# EAGLE design ACB-Light-R1.0-J01 (EAGLE 6.6.0)
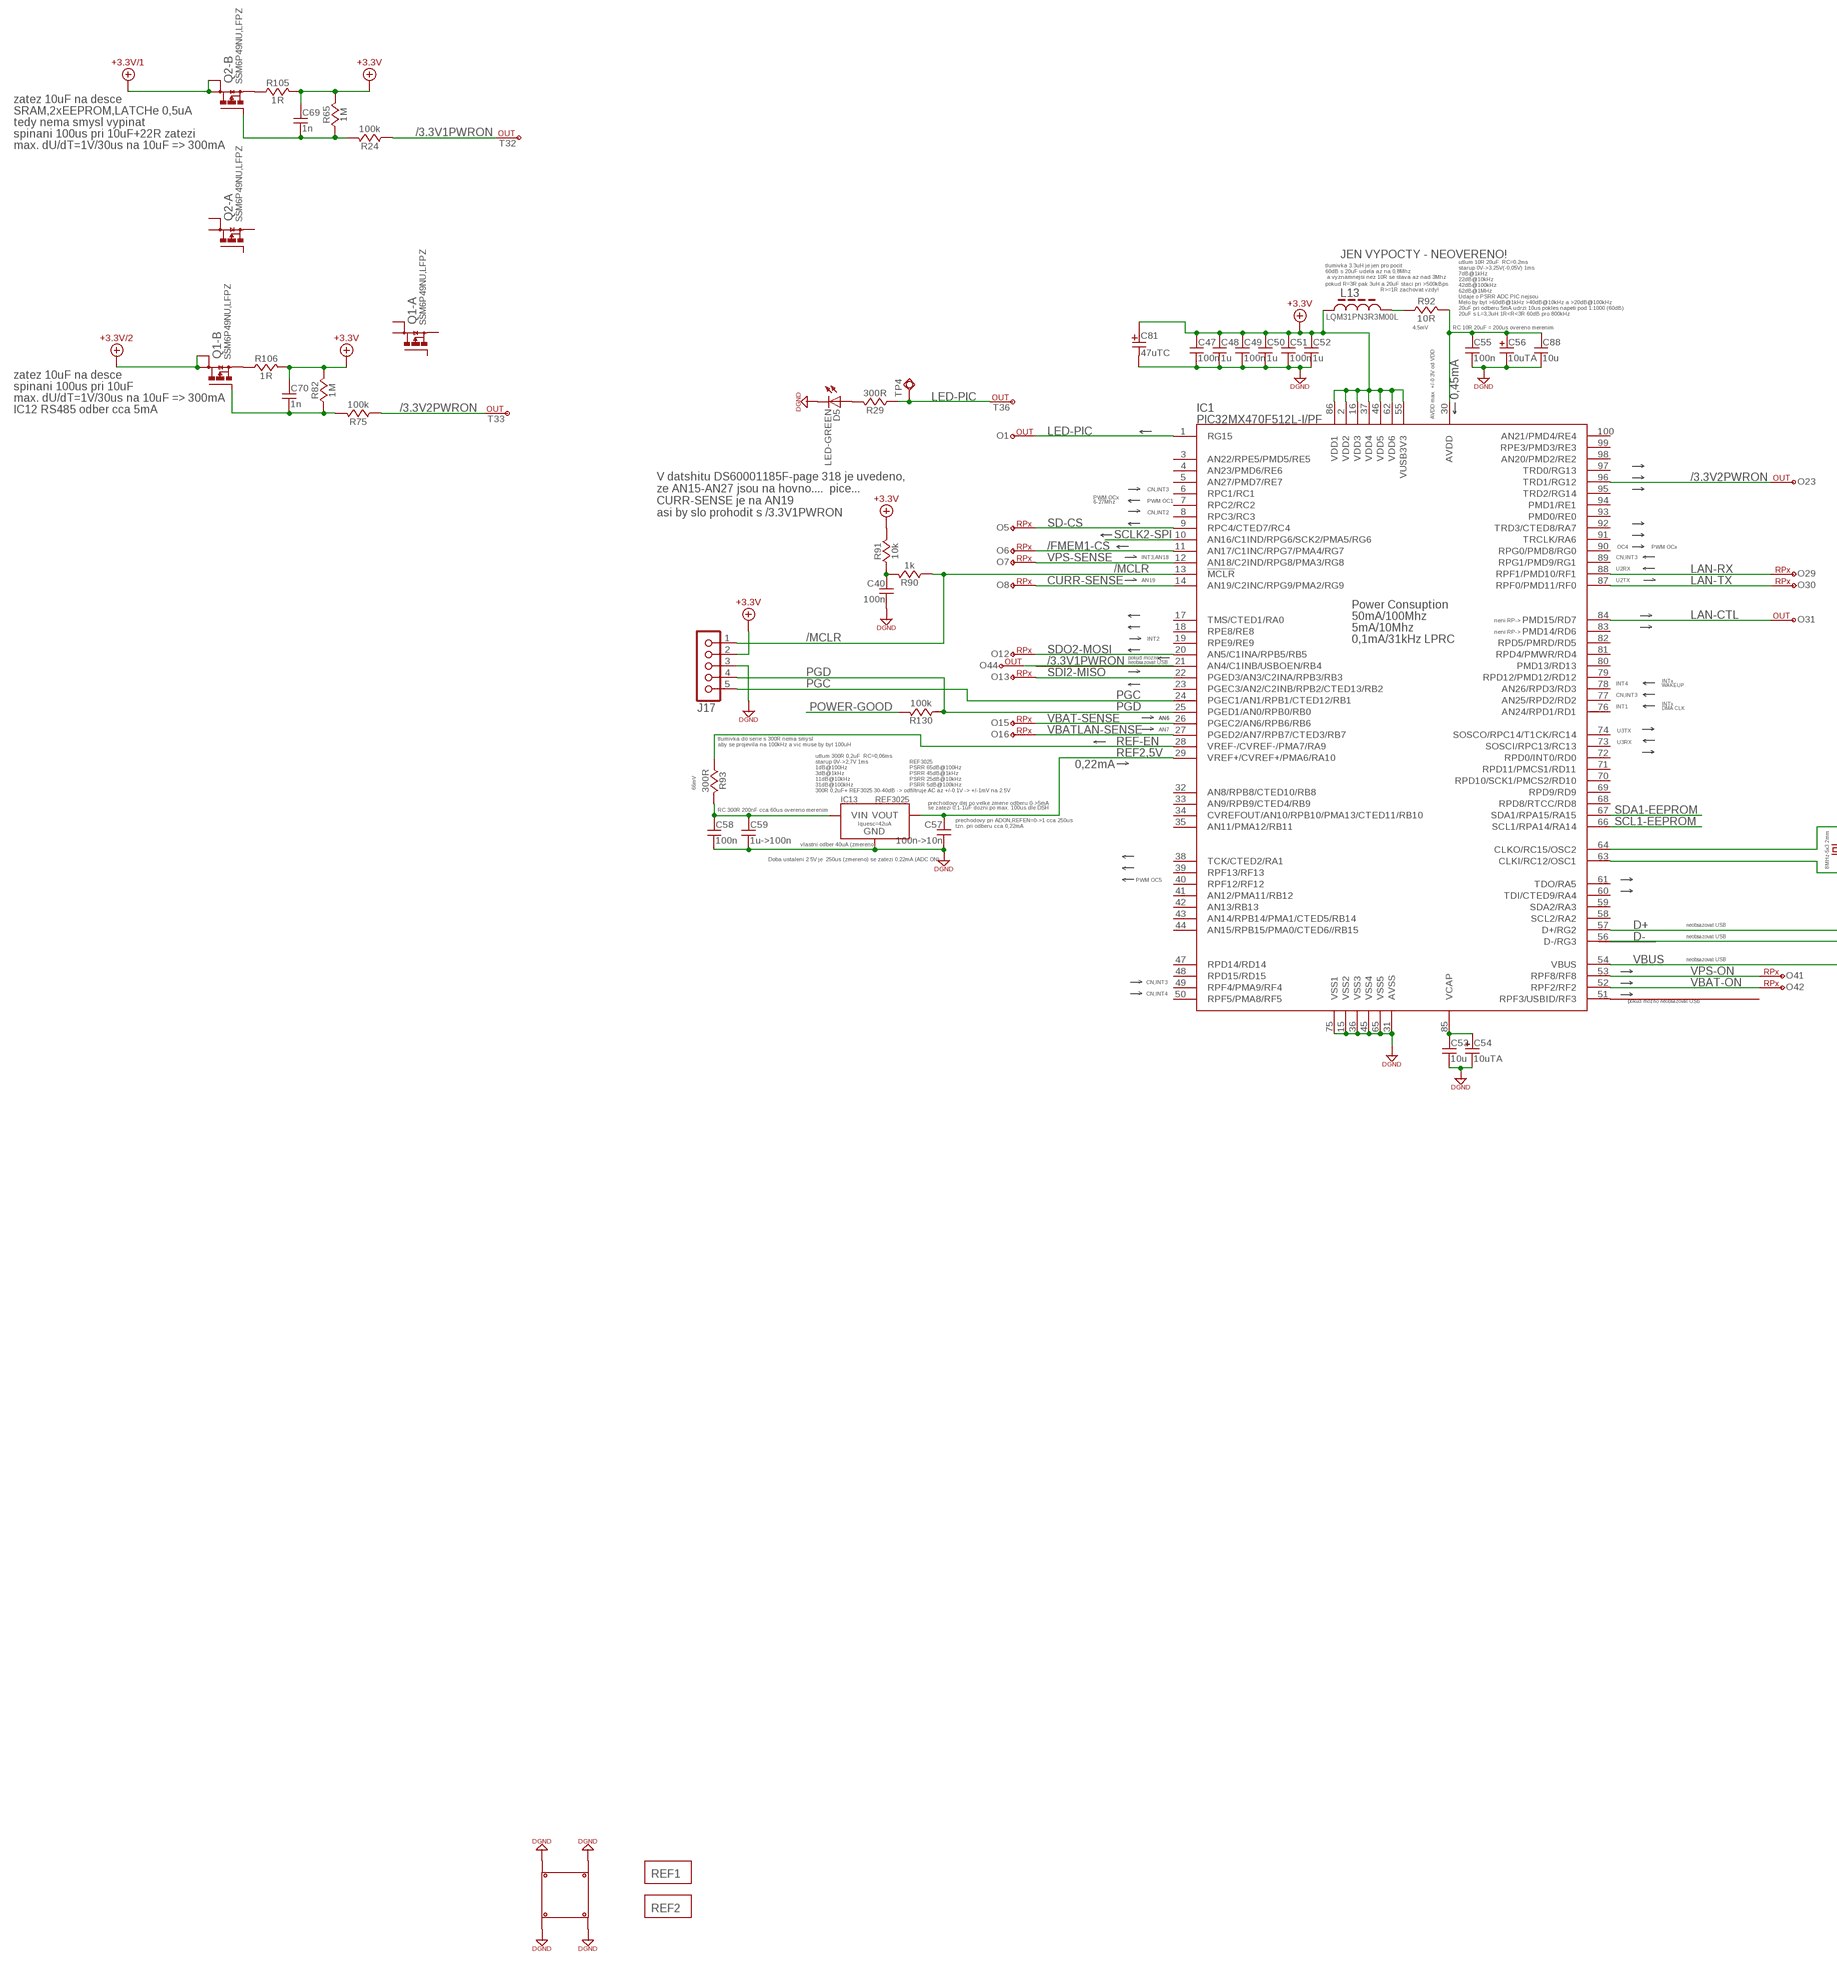
[diagram p0: schematic, sheet 1, part 1 of 3]
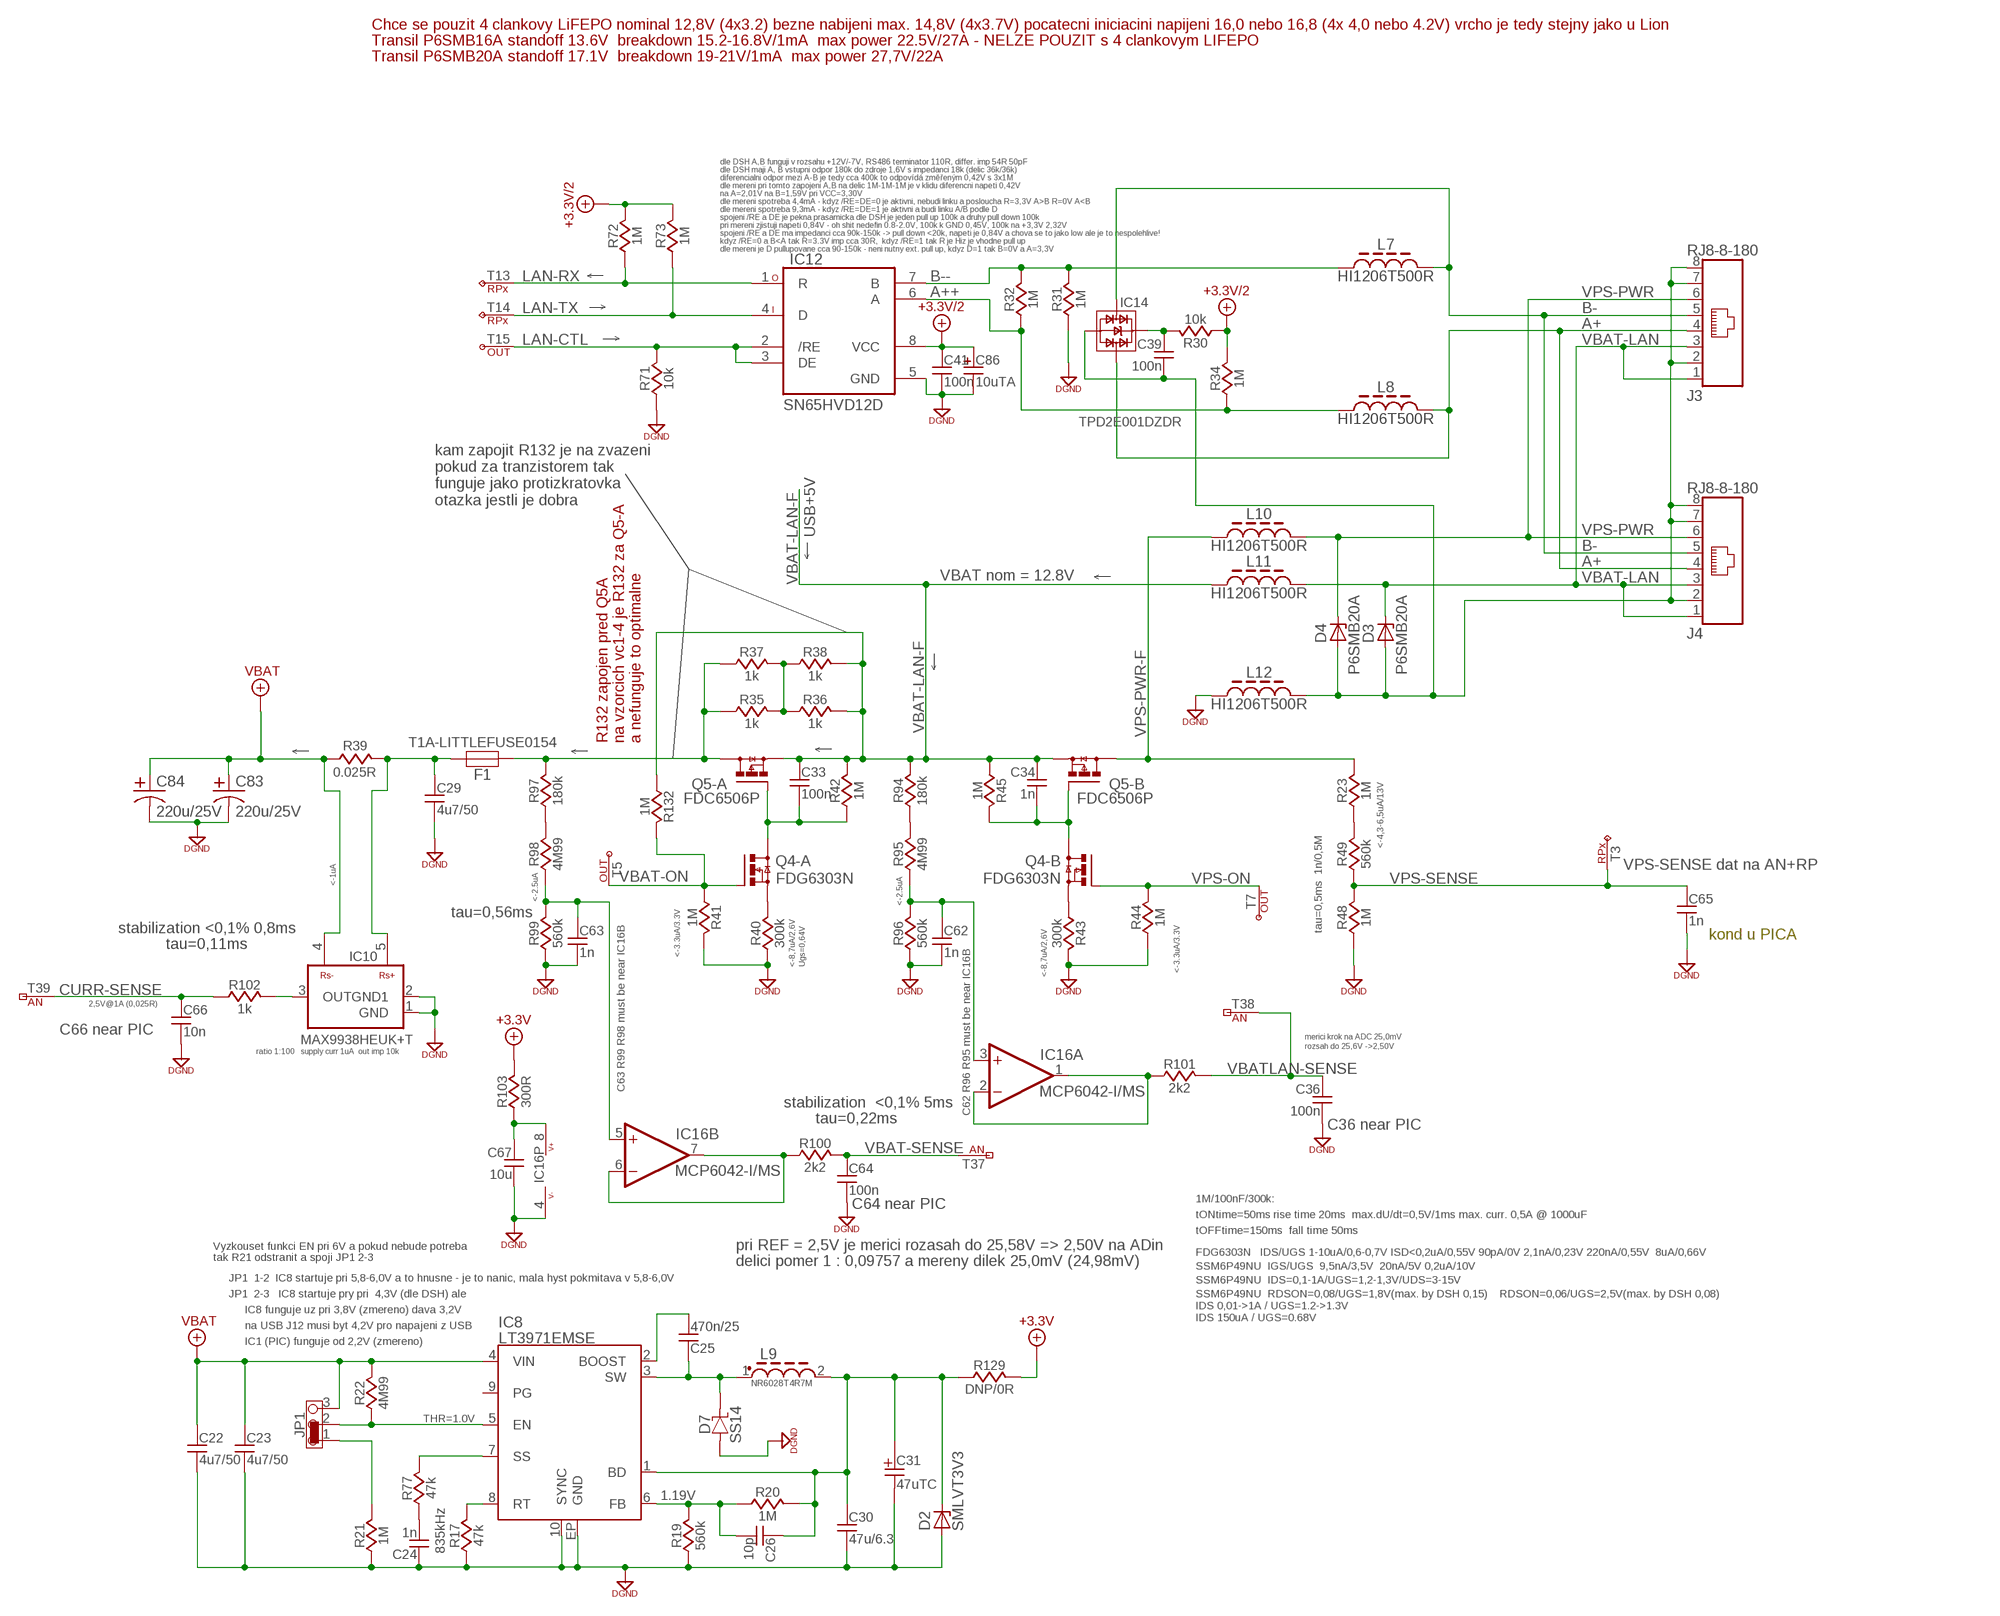
[diagram p1: schematic, sheet 1, part 2 of 3]
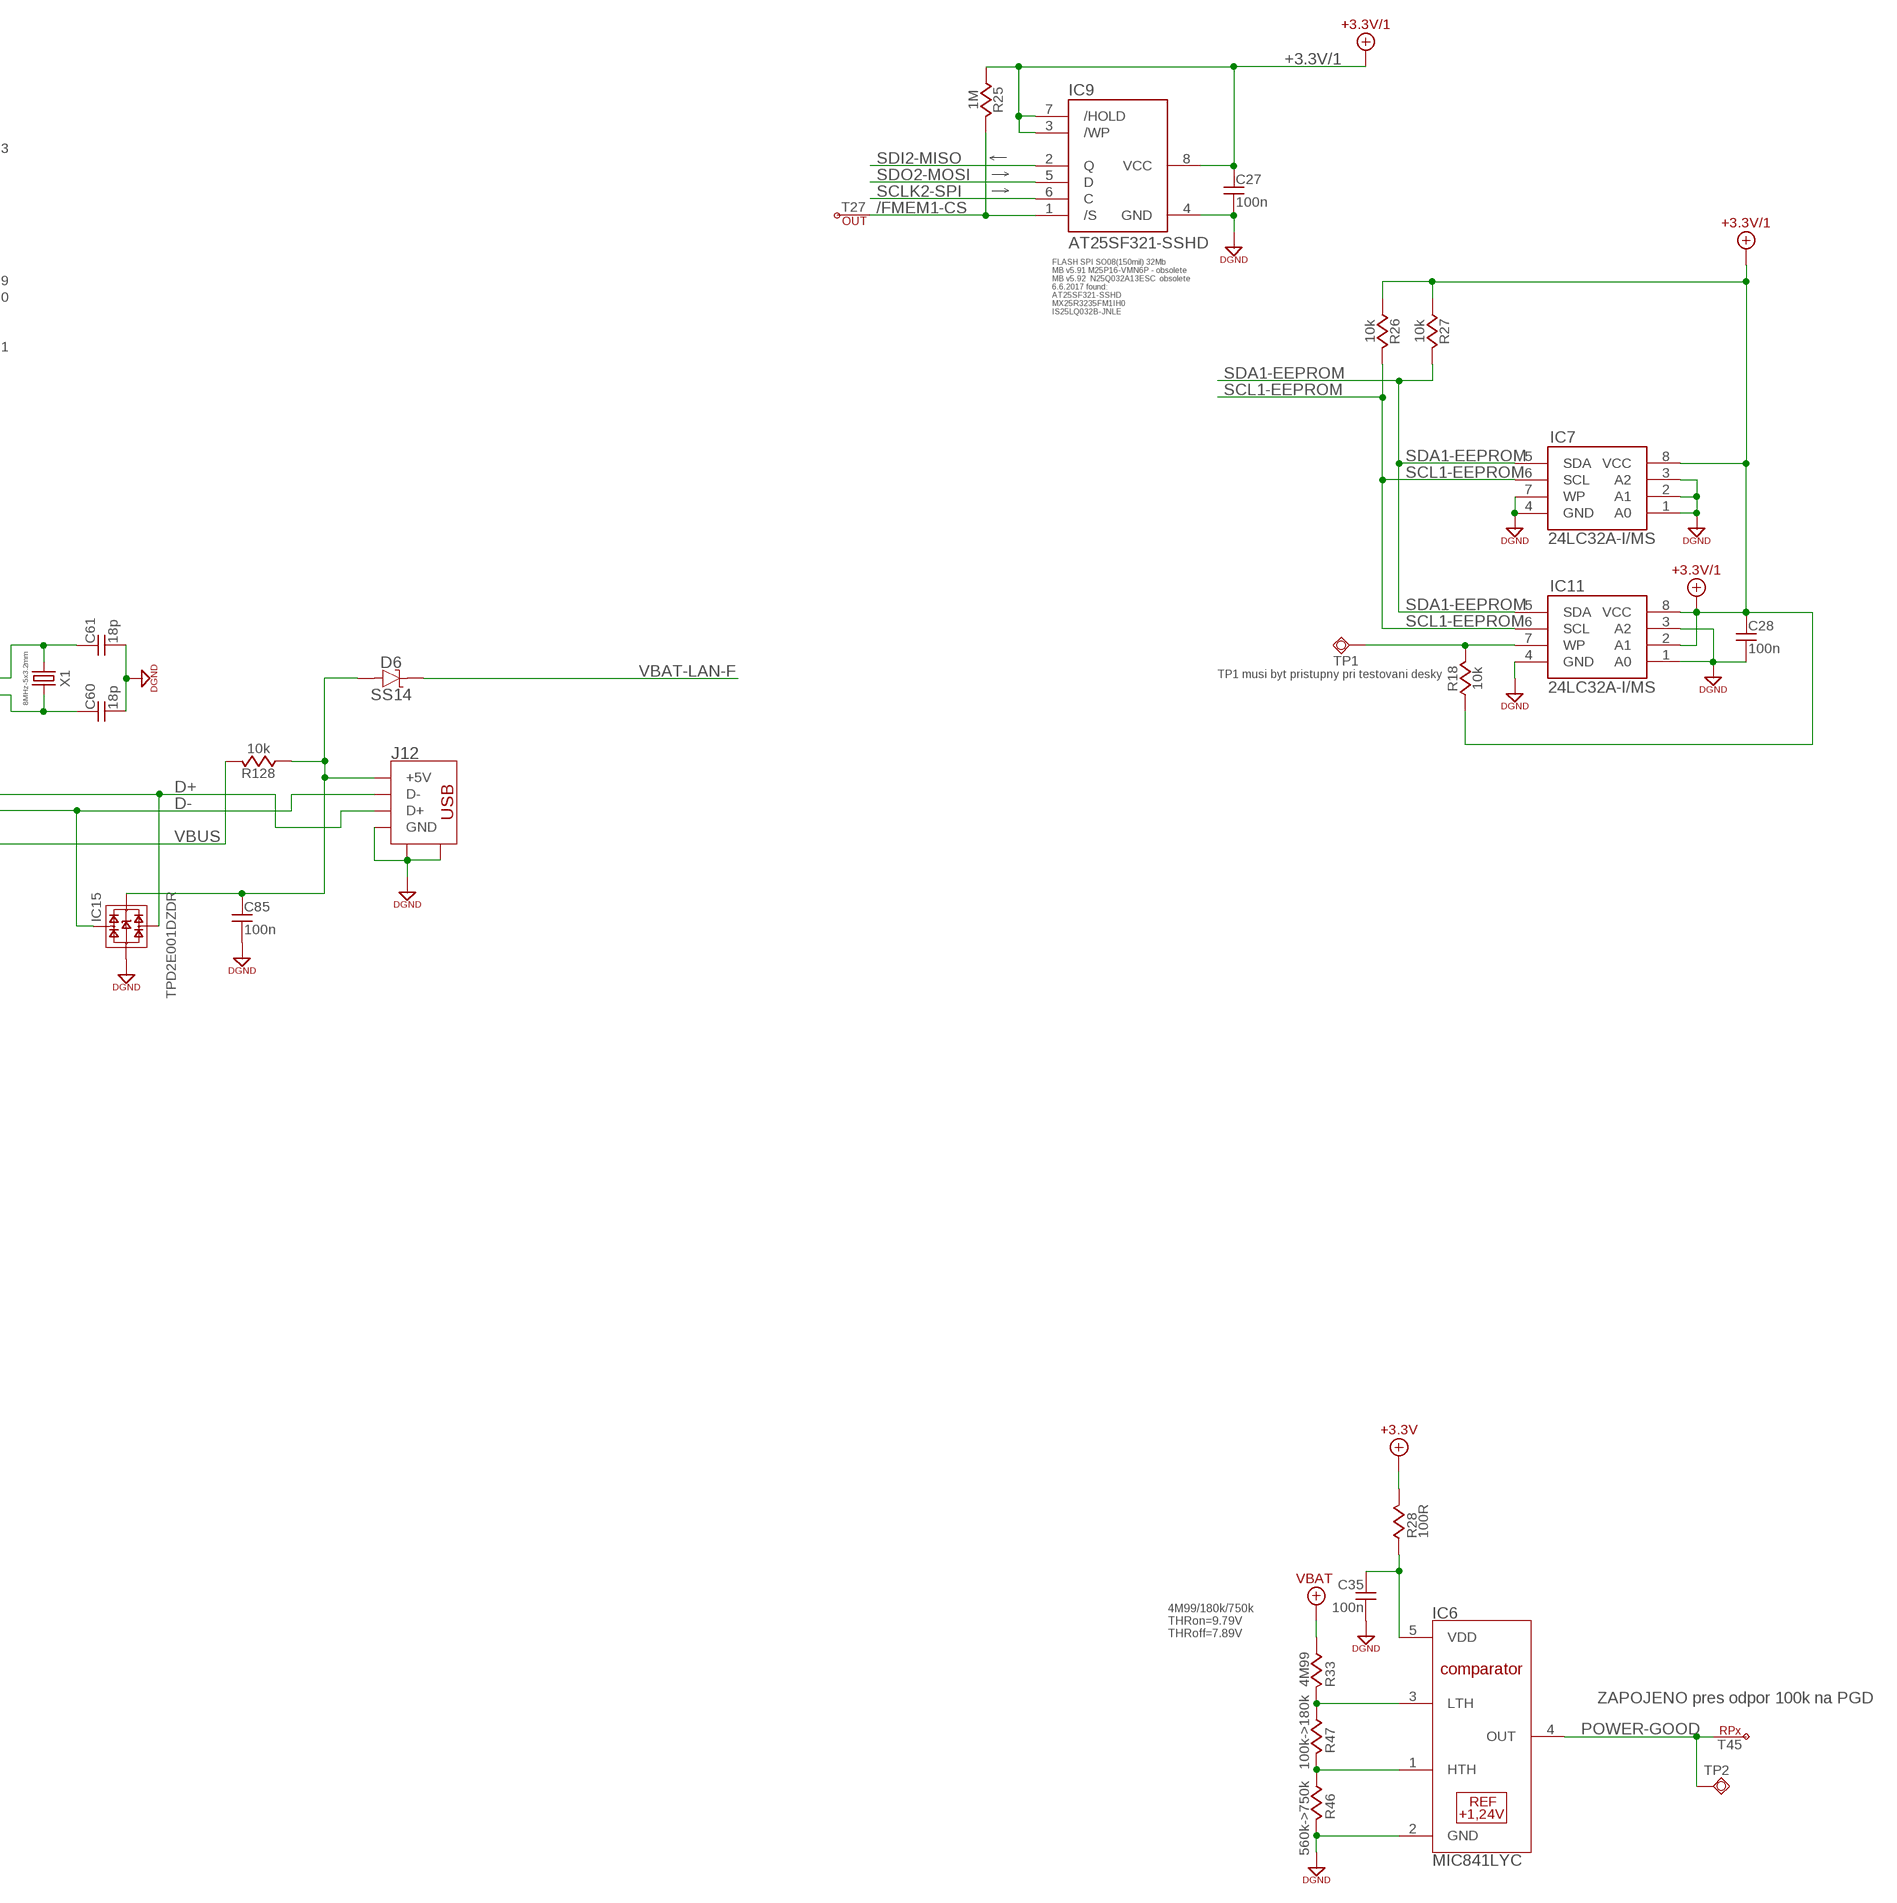
[diagram p2: schematic, sheet 1, part 3 of 3]

## Parts
C22  4u7/50  C-1206  [1206]
C23  4u7/50  C-1206  [1206]
C24  1n  C-0603  [0603]
C25  470n/25  C-0603  [0603]
C26  10p  C-0603  [0603]
C27  100n  C-0603  [0603]
C28  100n  C-0603  [0603]
C29  4u7/50  C-1206  [1206]
C30  47u/6.3  C-1206  [1206]
C31  47uTC  CT-C  [CT-C]
C33  100n  C-0603  [0603]
C34  1n  C-0603  [0603]
C35  100n  C-0603  [0603]
C36  100n  C-0603  [0603]
C39  100n  C-0603  [0603]
C40  100n  C-0603  [0603]
C41  100n  C-0603  [0603]
C47  100n  C-0603  [0603]
C48  1u  C-0603  [0603]
C49  100n  C-0603  [0603]
C50  1u  C-0603  [0603]
C51  100n  C-0603  [0603]
C52  1u  C-0603  [0603]
C53  10u  C-0603  [0603]
C54  10uTA  CT-1206  [1206-POL-C]
C55  100n  C-0603  [0603]
C56  10uTA  CT-1206  [1206-POL-C]
C57  100n->10n  C-0603  [0603]
C58  100n  C-0603  [0603]
C59  1u->100n  C-0603  [0603]
C60  18p  C-0603  [0603]
C61  18p  C-0603  [0603]
C62  1n  C-0603  [0603]
C63  1n  C-0603  [0603]
C64  100n  C-0603  [0603]
C65  1n  C-0603  [0603]
C66  10n  C-0603  [0603]
C67  10u  C-0603  [0603]
C69  1n  C-0603  [0603]
C70  1n  C-0603  [0603]
C81  47uTC  CT-C  [CT-C]
C83  220u/25V  CAP-ELEC-SMD-8MM  [CAP_8MM_DIA_SMT]
C84  220u/25V  CAP-ELEC-SMD-8MM  [CAP_8MM_DIA_SMT]
C85  100n  C-0603  [0603]
C86  10uTA  CT-1206  [1206-POL-C]
C88  10u  C-0603  [0603]
D2  SMLVT3V3  [SMA]
D3  P6SMB20A  P6SMB  [SMB]
D4  P6SMB20A  P6SMB  [SMB]
D5  LED-GREEN  LED-0805  [0805-POL-D]
D6  SS14  DS-SMA  [SMA]
D7  SS14  DS-SMA  [SMA]
F1  T1A-LITTLEFUSE0154  POJISTKA-LITTLEFUSE0154  [LITTLEFUSE0154]
IC1  PIC32MX470F512L-I/PF  [TQFP100_14X14_0,5MM]
IC6  MIC841LYC  [SC-70-5]
IC7  24LC32A-I/MS  24-I/MS  [MSOP-08]
IC8  LT3971EMSE  [MSOP10EXP]
IC9  AT25SF321-SSHD  M25P16-VMN6P  [SO-08]
IC10  MAX9938HEUK+T  TSM9938HEUK+T  [SOT23-5]
IC11  24LC32A-I/MS  24-I/MS  [MSOP-08]
IC12  SN65HVD12D  SN65HVD3082ED  [SO08]
IC13  REF3025  [SOT23]
IC14  TPD2E001DZDR  SR05.TCT  [SOT-143]
IC15  TPD2E001DZDR  SR05.TCT  [SOT-143]
IC16  MCP6042-I/MS  [MSOP-08]
J3  RJ8-8-180  [RJ8-8-180]
J4  RJ8-8-180  [RJ8-8-180]
J12  USB_A_180  USB_B_180  [USB_B_180]
J17  DNP-open-hole  MA05-1  [MA05-1]
JP1  JP3CLOSE12  [JP3CLOSE12]
L7  HI1206T500R  L-1206  [1206]
L8  HI1206T500R  L-1206  [1206]
L9  NR6028T4R7M  NR6028  [NR6028]
L10  HI1206T500R  L-1206  [1206]
L11  HI1206T500R  L-1206  [1206]
L12  HI1206T500R  L-1206  [1206]
L13  LQM31PN3R3M00L  L-1206  [1206]
O1  PIC-OUT  [TEMP-PAD]
O5  PIC-RPX  [TEMP-PAD]
O6  PIC-RPX  [TEMP-PAD]
O7  PIC-RPX  [TEMP-PAD]
O8  PIC-RPX  [TEMP-PAD]
O12  PIC-RPX  [TEMP-PAD]
O13  PIC-RPX  [TEMP-PAD]
O15  PIC-RPX  [TEMP-PAD]
O16  PIC-RPX  [TEMP-PAD]
O23  PIC-OUT  [TEMP-PAD]
O29  PIC-RPX  [TEMP-PAD]
O30  PIC-RPX  [TEMP-PAD]
O31  PIC-OUT  [TEMP-PAD]
O41  PIC-RPX  [TEMP-PAD]
O42  PIC-RPX  [TEMP-PAD]
O44  PIC-OUT  [TEMP-PAD]
PCB1  PCB-ACB  PCB-ACB-1  [PCB-ACB]
Q1  SSM6P49NU,LFPZ  [MICRO_FET]
Q2  SSM6P49NU,LFPZ  [MICRO_FET]
Q4  FDG6303N  [SC70-6]
Q5  FDC6506P  FDC6506D  [SSOT-6]
R17  47k  R-0603  [0603]
R18  10k  R-0603  [0603]
R19  560k  R-0603  [0603]
R20  1M  R-0603  [0603]
R21  1M  R-0603  [0603]
R22  4M99  R-0603  [0603]
R23  1M  R-0603  [0603]
R24  100k  R-0603  [0603]
R25  1M  R-0603  [0603]
R26  10k  R-0603  [0603]
R27  10k  R-0603  [0603]
R28  100R  R-0603  [0603]
R29  300R  R-0603  [0603]
R30  10k  R-0603  [0603]
R31  1M  R-0603  [0603]
R32  1M  R-0603  [0603]
R33  4M99  R-0603  [0603]
R34  1M  R-0603  [0603]
R35  1k  R-0805  [0805]
R36  1k  R-0805  [0805]
R37  1k  R-0805  [0805]
R38  1k  R-0805  [0805]
R39  0.025R  R-0805  [0805]
R40  300k  R-0603  [0603]
R41  1M  R-0603  [0603]
R42  1M  R-0603  [0603]
R43  300k  R-0603  [0603]
R44  1M  R-0603  [0603]
R45  1M  R-0603  [0603]
R46  560k->750k  R-0603  [0603]
R47  100k->180k  R-0603  [0603]
R48  1M  R-0603  [0603]
R49  560k  R-0603  [0603]
R65  1M  R-0603  [0603]
R71  10k  R-0603  [0603]
R72  1M  R-0603  [0603]
R73  1M  R-0603  [0603]
R75  100k  R-0603  [0603]
R77  47k  R-0603  [0603]
R82  1M  R-0603  [0603]
R90  1k  R-0603  [0603]
R91  10k  R-0603  [0603]
R92  10R  R-0603  [0603]
R93  300R  R-0603  [0603]
R94  180k  R-0603  [0603]
R95  4M99  R-0603  [0603]
R96  560k  R-0603  [0603]
R97  180k  R-0603  [0603]
R98  4M99  R-0603  [0603]
R99  560k  R-0603  [0603]
R100  2k2  R-0603  [0603]
R101  2k2  R-0603  [0603]
R102  1k  R-0603  [0603]
R103  300R  R-0603  [0603]
R105  1R  R-0805  [0805]
R106  1R  R-0805  [0805]
R128  10k  R-0603  [0603]
R129  DNP/0R  R-0603  [0603]
R130  100k  R-0603  [0603]
R132  1M  R-0603  [0603]
REF1  REF  [REF]
REF2  REF  [REF]
T3  PIC-RPX  [TEMP-PAD]
T5  PIC-OUT  [TEMP-PAD]
T7  PIC-OUT  [TEMP-PAD]
T13  PIC-RPX  [TEMP-PAD]
T14  PIC-RPX  [TEMP-PAD]
T15  PIC-OUT  [TEMP-PAD]
T27  PIC-OUT  [TEMP-PAD]
T32  PIC-OUT  [TEMP-PAD]
T33  PIC-OUT  [TEMP-PAD]
T36  PIC-OUT  [TEMP-PAD]
T37  PIN-AN  [TEMP-PAD]
T38  PIN-AN  [TEMP-PAD]
T39  PIN-AN  [TEMP-PAD]
T45  PIC-RPX  [TEMP-PAD]
TP1  DNP-TestPoint  ROUND_SMD1MM  [SMD_ROUND_1MM]
TP2  DNP-TestPoint  ROUND_SMDTH1.4MM  [TH_ROUND_14MM08MM]
TP4  DNP-TestPoint  ROUND_SMDTH1.4MM  [TH_ROUND_14MM08MM]
X1  8MHz-5x3.2mm  XTAL-7B  [7B]

## Nets
+3,3V-FILT: C35.1 IC6.5(VDD) R28.1
+3.3V: C47.1 C48.1 C49.1 C50.1 C51.1 C52.1 C69.1 C70.1 C81.+ IC1.2(VDD2) IC1.16(VDD3) IC1.37(VDD4) IC1.46(VDD5) IC1.55(VUSB3V3) IC1.62(VDD6) IC1.86(VDD1) J17.2 L13.1 R28.2 R65.1 R82.1 R91.2 R103.2 R105.2 R106.2 R129.1
+3.3V/1: C27.1 C28.1 IC7.8(VCC) IC9.3(/WP) IC9.7(/HOLD) IC9.8(VCC) IC11.2(A1) IC11.8(VCC) Q2.3(-B:D) Q2.P2(-B:D1) R18.1 R25.2 R26.1 R27.1
+3.3V/2: C41.1 C86.+ IC12.8(VCC) Q1.3(-B:D) Q1.P2(-B:D1) R30.2 R34.1 R72.1 R73.2
/3.3V1PWRON: IC1.21(AN4/C1INB/USBOEN/RB4) O44.P$1(TP) R24.2 T32.P$1(TP)
/3.3V2PWRON: IC1.96(TRD1/RG12) O23.P$1(TP) R75.2 T33.P$1(TP)
/FMEM1-CS: IC1.11(AN17/C1INC/RPG7/PMA4/RG7) IC9.1(/S) O6.P$1(TP) R25.1 T27.P$1(TP)
/MCLR: IC1.13(!MCLR) J17.1 R90.2
A+ [HV]: IC14.3 J3.4 J4.4 L8.2
A++ [HV]: IC12.6(A) L8.1 R32.2 R34.2
AVDD: C55.1 C56.+ C88.1 IC1.30(AVDD) R92.2
B- [HV]: IC14.2 J3.5 J4.5 L7.2
B-- [HV]: IC12.7(B) L7.1 R31.1 R32.1
CURR-SENSE: C66.1 IC1.14(AN19/C2INC/RPG9/PMA2/RG9) O8.P$1(TP) R102.2 T39.P$1(TP)
D+: IC1.57(D+/RG2) IC15.3 J12.3_D+(D+)
D-: IC1.56(D-/RG3) IC15.2 J12.2_D-(D-)
DGND [GND]: C22.2 C23.2 C24.1 C27.2 C28.2 C29.2 C30.2 C31.- C35.2 C36.2 C40.2 C41.2 C47.2 C48.2 C49.2 C50.2 C51.2 C52.2 C53.2 C54.- C55.2 C56.- C57.2 C58.2 C59.2 C60.2 C61.2 C62.2 C63.2 C64.2 C65.2 C66.2 C67.2 C81.- C83.2 C84.2 C85.2 C86.- C88.2 D2.-(A) D5.K D7.A IC1.15(VSS2) IC1.31(AVSS) IC1.36(VSS3) IC1.45(VSS4) IC1.65(VSS5) IC1.75(VSS1) IC6.2(GND) IC7.1(A0) IC7.2(A1) IC7.3(A2) IC7.4(GND) IC7.7(WP) IC8.10(SYNC) IC8.EP(GND) IC9.4(GND) IC10.1(GND) IC10.2(GND1) IC11.1(A0) IC11.3(A2) IC11.4(GND) IC12.5(GND) IC13.3(GND) IC15.1 IC16.4(P:V-) J12.4_GND(GND) J12.SH1(GND_SH1) J12.SH2(GND_SH2) J17.3 L12.1 PCB1.PAD_GND_1 PCB1.PAD_GND_2 PCB1.PAD_GND_3 PCB1.PAD_GND_4 R17.2 R19.2 R21.2 R31.2 R40.1 R41.2 R43.1 R44.2 R46.1 R48.1 R71.2 R96.2 R99.2
DGND-F [HV]: C39.2 D3.A D4.A IC14.1 J3.2 J3.7 J3.8 J4.2 J4.7 J4.8 L12.2
GATE-Q12A: C33.2 Q4.6(-A:D) Q5.1(-A:G) R42.2
GATE-Q12B: C34.2 Q4.3(-B:D) Q5.3(-B:G) R45.2
LAN-CTL: IC1.84(PMD15/RD7) IC12.2(/RE) IC12.3(DE) O31.P$1(TP) R71.1 T15.P$1(TP)
LAN-RX: IC1.88(RPF1/PMD10/RF1) IC12.1(R) O29.P$1(TP) R72.2 T13.P$1(TP)
LAN-TX: IC1.87(RPF0/PMD11/RF0) IC12.4(D) O30.P$1(TP) R73.1 T14.P$1(TP)
LED-PIC: IC1.1(RG15) O1.P$1(TP) R29.1 T36.P$1(TP) TP4.P$1(TP)
N$13: IC11.7(WP) R18.2 TP1.P$1(TP)
N$14: D5.A R29.2
N$16: Q4.1(-A:S) R40.2
N$17: Q4.4(-B:S) R43.2
N$18: C39.1 IC14.4 R30.1
N$20 [HV]: R35.2 R36.1 R37.2 R38.1
N$21 [HV]: C29.1 F1.1 IC10.5(VIN+) R39.2
N$24: L13.2 R92.1
N$27: IC6.1(HTH) R46.2 R47.1
N$28: IC6.3(LTH) R33.1 R47.2
N$32: C61.1 IC1.64(CLKO/RC15/OSC2) X1.1
N$36: Q1.4(-B:S) R106.1
N$38 [HV]: F1.2 Q5.6(-A:D) R35.1 R37.1 R97.1
N$39: C60.1 IC1.63(CLKI/RC12/OSC1) X1.3
N$44: C58.1 C59.1 IC13.1(VIN) R93.2
N$48: R94.2 R95.1
N$49: C62.1 IC16.3(A:+IN) R95.2 R96.1
N$50: C26.2 IC8.6(FB) R19.1 R20.2
N$51: C24.2 R77.2
N$52 [HV]: C25.1 D7.K IC8.3(SW) L9.1
N$53: IC8.8(RT) R17.1
N$54: IC8.7(SS) R77.1
N$55 [HV]: IC8.5(EN) JP1.2 R22.2
N$56: Q2.4(-B:S) R105.1
N$57 [HV]: C25.2 IC8.2(BOOST)
N$60: R97.2 R98.1
N$62: R23.1 R49.2
N$63: C63.1 IC16.5(B:+IN) R98.2 R99.1
N$64: IC16.6(B:-IN) IC16.7(B:OUT) R100.2
N$65: C67.1 IC16.8(P:V+) R103.1
N$66: IC16.1(A:OUT) IC16.2(A:-IN) R101.2
N$67: C69.2 Q2.5(-B:G) R24.1 R65.2
N$68: IC10.3(OUT) R102.1
N$70: C40.1 R90.1 R91.1
N$73: C70.2 Q1.5(-B:G) R75.1 R82.2
N$85 [HV]: C85.1 D6.A IC15.4 J12.1_+5V(+5V) R128.1
N$87 [HV]: JP1.1 R21.1
OUT+3.3V [GND]: C26.1 C30.1 C31.+ D2.+(C) IC8.1(BD) L9.2 R20.1 R129.2
PGC: IC1.24(PGEC1/AN1/RPB1/CTED12/RB1) J17.5
PGD: IC1.25(PGED1/AN0/RPB0/RB0) J17.4 R130.2
POWER-GOOD: IC6.4(OUT) R130.1 T45.P$1(TP) TP2.P$1(TP)
REF2,5V: C57.1 IC1.29(VREF+/CVREF+/PMA6/RA10) IC13.2(VOUT)
REF-EN: IC1.28(VREF-/CVREF-/PMA7/RA9) R93.1
SCL1-EEPROM: IC1.66(SCL1/RPA14/RA14) IC7.6(SCL) IC11.6(SCL) R26.2
SCLK2-SPI: IC1.10(AN16/C1IND/RPG6/SCK2/PMA5/RG6) IC9.6(C)
SD-CS: IC1.9(RPC4/CTED7/RC4) O5.P$1(TP)
SDA1-EEPROM: IC1.67(SDA1/RPA15/RA15) IC7.5(SDA) IC11.5(SDA) R27.2
SDI2-MISO: IC1.22(PGED3/AN3/C2INA/RPB3/RB3) IC9.2(Q) O13.P$1(TP)
SDO2-MOSI: IC1.20(AN5/C1INA/RPB5/RB5) IC9.5(D) O12.P$1(TP)
VBAT [HV]: C22.1 C23.1 C83.1 C84.1 IC8.4(VIN) IC10.4(VIN-) JP1.3 R22.1 R33.2 R39.1
VBAT-LAN [HV]: D3.C J3.1 J3.3 J4.1 J4.3 L11.2
VBAT-LAN-F [HV]: C33.1 C34.1 D6.K L11.1 Q5.2(-B:S) Q5.5(-A:S) R36.2 R38.2 R42.1 R45.1 R94.1 R132.1
VBAT-ON: IC1.52(RPF2/RF2) O42.P$1(TP) Q4.2(-A:G) R41.1 R132.2 T5.P$1(TP)
VBAT-SENSE: C64.1 IC1.26(PGEC2/AN6/RPB6/RB6) O15.P$1(TP) R100.1 T37.P$1(TP)
VBATLAN-SENSE: C36.1 IC1.27(PGED2/AN7/RPB7/CTED3/RB7) O16.P$1(TP) R101.1 T38.P$1(TP)
VBUS: IC1.54(VBUS) R128.2
VCAP: C53.1 C54.+ IC1.85(VCAP)
VPS-ON: IC1.53(RPF8/RF8) O41.P$1(TP) Q4.5(-B:G) R44.1 T7.P$1(TP)
VPS-PWR [HV]: D4.C J3.6 J4.6 L10.2
VPS-PWR-F: L10.1 Q5.4(-B:D) R23.2
VPS-SENSE: C65.1 IC1.12(AN18/C2IND/RPG8/PMA3/RG8) O7.P$1(TP) R48.2 R49.1 T3.P$1(TP)
Unconnected: IC1.3(AN22/RPE5/PMD5/RE5) IC1.4(AN23/PMD6/RE6) IC1.5(AN27/PMD7/RE7) IC1.6(RPC1/RC1) IC1.7(RPC2/RC2) IC1.8(RPC3/RC3) IC1.17(TMS/CTED1/RA0) IC1.18(RPE8/RE8) IC1.19(RPE9/RE9) IC1.23(PGEC3/AN2/C2INB/RPB2/CTED13/RB2) IC1.32(AN8/RPB8/CTED10/RB8) IC1.33(AN9/RPB9/CTED4/RB9) IC1.34(CVREFOUT/AN10/RPB10/PMA13/CTED11/RB10) IC1.35(AN11/PMA12/RB11) IC1.38(TCK/CTED2/RA1) IC1.39(RPF13/RF13) IC1.40(RPF12/RF12) IC1.41(AN12/PMA11/RB12) IC1.42(AN13/RB13) IC1.43(AN14/RPB14/PMA1/CTED5/RB14) IC1.44(AN15/RPB15/PMA0/CTED6//RB15) IC1.47(RPD14/RD14) IC1.48(RPD15/RD15) IC1.49(RPF4/PMA9/RF4) IC1.50(RPF5/PMA8/RF5) IC1.51(RPF3/USBID/RF3) IC1.58(SCL2/RA2) IC1.59(SDA2/RA3) IC1.60(TDI/CTED9/RA4) IC1.61(TDO/RA5) IC1.68(RPD8/RTCC/RD8) IC1.69(RPD9/RD9) IC1.70(RPD10/SCK1/PMCS2/RD10) IC1.71(RPD11/PMCS1/RD11) IC1.72(RPD0/INT0/RD0) IC1.73(SOSCI/RPC13/RC13) IC1.74(SOSCO/RPC14/T1CK/RC14) IC1.76(AN24/RPD1/RD1) IC1.77(AN25/RPD2/RD2) IC1.78(AN26/RPD3/RD3) IC1.79(RPD12/PMD12/RD12) IC1.80(PMD13/RD13) IC1.81(RPD4/PMWR/RD4) IC1.82(RPD5/PMRD/RD5) IC1.83(PMD14/RD6) IC1.89(RPG1/PMD9/RG1) IC1.90(RPG0/PMD8/RG0) IC1.91(TRCLK/RA6) IC1.92(TRD3/CTED8/RA7) IC1.93(PMD0/RE0) IC1.94(PMD1/RE1) IC1.95(TRD2/RG14) IC1.97(TRD0/RG13) IC1.98(AN20/PMD2/RE2) IC1.99(RPE3/PMD3/RE3) IC1.100(AN21/PMD4/RE4) IC8.9(PG) Q1.1(-A:S) Q1.2(-A:G) Q1.6(-A:D) Q1.P1(-A:D1) Q2.1(-A:S) Q2.2(-A:G) Q2.6(-A:D) Q2.P1(-A:D1)

## Notes on the sheet
- Chce se pouzit 4 clankovy LiFEPO nominal 12,8V (4x3.2) bezne nabijeni max. 14,8V (4x3.7V) pocatecni iniciacini napijeni 16,0 nebo 16,8 (4x 4,0 nebo 4.2V) vrcho je tedy stejny jako u Lion
- Transil P6SMB16A standoff 13.6V  breakdown 15.2-16.8V/1mA  max power 22.5V/27A - NELZE POUZIT s 4 clankovym LIFEPO
- Transil P6SMB20A standoff 17.1V  breakdown 19-21V/1mA  max power 27,7V/22A
- dle DSH A,B funguji v rozsahu +12V/-7V, RS486 terminator 110R, differ. imp 54R 50pF
- dle DSH maji A, B vstupni odpor 180k do zdroje 1,6V s impedanci 18k (delic 36k/36k)
- diferencialni odpor mezi A-B je tedy cca 400k to odpovídá změřeným 0,42V s 3x1M
- dle mereni pri tomto zapojeni A,B na delic 1M-1M-1M je v klidu diferencni napeti 0,42V
- na A=2,01V na B=1,59V pri VCC=3,30V
- dle mereni spotreba 4,4mA - kdyz /RE=DE=0 je aktivni, nebudi linku a posloucha R=3,3V A>B R=0V A<B
- dle mereni spotreba 9,3mA - kdyz /RE=DE=1 je aktivni a budi linku A/B podle D
- spojeni /RE a DE je pekna prasarnicka dle DSH je jeden pull up 100k a druhy pull down 100k
- pri mereni zjistuji napeti 0,84V - oh shit nedefin 0.8-2.0V, 100k k GND 0,45V, 100k na +3,3V 2,32V
- spojeni /RE a DE ma impedanci cca 90k-150k -> pull down <20k, napeti je 0,84V a chova se to jako low ale je to nespolehlive!
- kdyz /RE=0 a B<A tak R=3.3V imp cca 30R,  kdyz /RE=1 tak R je Hiz je vhodne pull up
- dle mereni je D pullupovane cca 90-150k - neni nutny ext. pull up, kdyz D=1 tak B=0V a A=3,3V
- O
- I
- kam zapojit R132 je na zvazeni
  pokud za tranzistorem tak
  funguje jako protizkratovka
  otazka jestli je dobra
- USB+5V
- VBAT nom = 12.8V
- R132 zapojen pred Q5A 
  na vzorcich vc1-4 je R132 za Q5-A 
  a nefunguje to optimalne
- <-4,3-6,5uA/13V
- VPS-SENSE dat na AN+RP
- <-1uA
- <-2.5uA
- <-2.5uA
- tau=0,56ms
- stabilization <0,1% 0,8ms | tau=0,5ms  1n/0,5M
- kond u PICA
- tau=0,11ms
- <-3.3uA/3.3V
- <-8,7uA/2,6V | Ugs=0,64V
- <-3.3uA/3.3V
- <-8,7uA/2,6V
- 2,5V@1A (0,025R)
- C66 near PIC
- merici krok na ADC 25,0mV
- rozsah do 25,6V ->2,50V
- ratio 1:100   supply curr 1uA  out imp 10k
- C63 R99 R98 must be near IC16B
- stabilization  <0,1% 5ms
- C62 R96 R95 must be near IC16B
- tau=0,22ms
- C36 near PIC
- 1M/100nF/300k:
- C64 near PIC
- tONtime=50ms rise time 20ms  max.dU/dt=0,5V/1ms max. curr. 0,5A @ 1000uF
- tOFFtime=150ms  fall time 50ms
- Vyzkouset funkci EN pri 6V a pokud nebude potreba | pri REF = 2,5V je merici rozasah do 25,58V => 2,50V na ADin
- FDG6303N   IDS/UGS 1-10uA/0,6-0,7V ISD<0,2uA/0,55V 90pA/0V 2,1nA/0,23V 220nA/0,55V  8uA/0,66V
- tak R21 odstranit a spoji JP1 2-3
- delici pomer 1 : 0,09757 a mereny dilek 25,0mV (24,98mV)
- SSM6P49NU  IGS/UGS  9,5nA/3,5V  20nA/5V 0,2uA/10V
- JP1  1-2  IC8 startuje pri 5,8-6,0V a to hnusne - je to nanic, mala hyst pokmitava v 5,8-6,0V | SSM6P49NU  IDS=0,1-1A/UGS=1,2-1,3V/UDS=3-15V
- JP1  2-3   IC8 startuje pry pri  4,3V (dle DSH) ale | SSM6P49NU  RDSON=0,08/UGS=1,8V(max. by DSH 0,15)    RDSON=0,06/UGS=2,5V(max. by DSH 0,08)
- IDS 0,01->1A / UGS=1.2->1.3V
- IC8 funguje uz pri 3,8V (zmereno) dava 3,2V
- IDS 150uA / UGS=0.68V
- na USB J12 musi byt 4,2V pro napajeni z USB
- IC1 (PIC) funguje od 2,2V (zmereno)
- zatez 10uF na desce
- SRAM,2xEEPROM,LATCHe 0,5uA
- tedy nema smysl vypinat
- spinani 100us pri 10uF+22R zatezi | THR=1.0V
- max. dU/dT=1V/30us na 10uF => 300mA
- 1.19V
- 835kHz
- JEN VYPOCTY - NEOVERENO!
- utlum 10R 20uF  RC=0,2ms
- tlumivka 3.3uH je jen pro pocit
- starup 0V->3,25V(-0,05V) 1ms
- 60dB s 20uF udela az na 0,8Mhz
- 7dB@1kHz
- a vyznamnejsi nez 10R se stava az nad 3Mhz
- 22dB@10kHz
- pokud R=3R pak 3uH a 20uF staci pri >500kBps | 42dB@100kHz
- R>=1R zachovat vzdy! | 62dB@1MHz
- Udaje o PSRR ADC PIC nejsou
- Melo by byt >60dB@1kHz >40dB@10kHz a >20dB@100kHz
- 20uF pri odberu 5mA udrzi 10us pokles napeti pod 1:1000 (60dB)
- 20uF s L=3,3uH 1R<R<3R 60dB pro 800kHz
- 4,5mV | RC 10R 20uF = 200us overeno merenim
- zatez 10uF na desce
- spinani 100us pri 10uF
- max. dU/dT=1V/30us na 10uF => 300mA | 0,45mA
- IC12 RS485 odber cca 5mA
- AVDD max. +/-0.3V od VDD
- added EMI choke
- I in ->
- 0.1uF->1uF
- CN,INT3
- PWM OCx
- 6-27Mhz | PWM OC1
- added EMI choke
- CN,INT2
- V datshitu DS60001185F-page 318 je uvedeno,
  ze AN15-AN27 jsou na hovno....  pice...
  CURR-SENSE je na AN19
  asi by slo prohodit s /3.3V1PWRON
- added 1000uF
- OC4 | PWM OCx
- INT3,AN18 | CN,INT3 | IC7 power consuption =  22uA + 19% I in
- FLASH SPI SO08(150mil) 32Mb
- efficiency 81% *  ( Iin -27uA) / I in
- MB v5.91 M25P16-VMN6P - obsolete
- U2RX
- MB v5.92  N25Q032A13ESC  obsolete
- 6.6.2017 found:
- AN19 | U2TX
- AT25SF321-SSHD
- MX25R3235FM1IH0
- IS25LQ032B-JNLE
- Power Consuption
- 1.6.2015 v5.9  pridat RC FILTR 1R/2x47uF  a DC vazba je az R84
- 50mA/100Mhz | otestovalo se to a zda se to dobre
- neni RP->
- 5mA/10Mhz
- neni RP->
- INT2
- 0,1mA/31kHz LPRC
- pokud mozno
- neobsazovat USB
- INTx
- INT4
- WAKEUP
- CN,INT3
- INTx
- INT1
- DMA CLK
- AN6 | AN6
- AN7 | U3TX
- tlumivka do serie s 300R nema smysl
- U3RX
- aby se projevila na 100kHz a vic muse by byt 100uH
- utlum 300R 0,2uF  RC=0,06ms
- starup 0V->2,7V 1ms | REF3025
- 1dB@100Hz | PSRR 65dB@100Hz | 0,22mA
- 3dB@1kHz | PSRR 45dB@1kHz
- 11dB@10kHz | PSRR 25dB@10kHz
- 31dB@100kHz | PSRR 5dB@100kHz
- 66mV
- 300R 0,2uF+ REF3025 30-40dB -> odfiltruje AC az +/-0.1V -> +/-1mV na 2.5V
- prechodovy dej po velke zmene odberu 0->5mA
- se zatezi 0,1-1uF dozni po max. 100us dle DSH
- RC 300R 200nF cca 60us overeno merenim
- prechodovy pri ADON,REFEN=0->1 cca 250us
- Iquesc=42uA
- tzn. pri odberu cca 0,22mA
- vlastni odber 40uA (zmereno)
- TP1 musi byt pristupny pri testovani desky
- Doba ustaleni 2.5V je  250us (zmereno) se zatezi 0,22mA (ADC ON)
- PWM OC5
- neobsazovat USB
- neobsazovat USB
- neobsazovat USB
- CN,INT3
- CN,INT4
- pokud mozno neobsazovat USB
- 4M99/180k/750k
  THRon=9.79V
  THRoff=7.89V
- ZAPOJENO pres odpor 100k na PGD

## Library data of the parts
C22 C23 C29 C30 = DISCRETE:C-1206: Capacitor 1206
C24-C28 C33-C36 C39-C41 C47-C53 C55 C57-C67 C69 C70 C85 C88 = DISCRETE:C-0603
C31 C81 = SmdDisc:CT
C54 C56 C86 = DISCRETE:CT-1206
C83 C84 = SMD-ELYT:CAP-ELEC-SMD
D2 = st-microelectronics-AOM:SMLVT3V3: TVS 600W 4.1 Breakdown
D3 D4 = Littelfuse:P6SMB: P6SMB20A TVS Unidirectional 17.1V 1uA, 19.0-21.0V@1mA breakdown, 27.7V@22A P6SMB16A TVS Unidirectional 13.6V 1uA, 15.2-16.8V@1mA breakdown, 22.5V@27A
D5 = DISCRETE:LED-0805
D6 D7 = SmdDisc:DS: Diody schotki: 1) BAT48 MELF1406 signalova 40V 0,3V/10mA 0,5V/0,2A 30pF,10pF/5V 3uA/50°C 2) SS14 SMA power 40V 0,2V/10mA 0,4V/1A 300pF,60pF/20V 200uA/75°C
F1 = ArdDisp:POJISTKA: Pojistka 1) klasicka 5x20 ve vyvodovem pouzdru KS20SW 2) SMD 2410 (6x2,6mm) v pouzdru Littlefuse 0154
IC1 = ACB:PIC32MX470F512L: Jara 6.6.2017 sym, pac12x12 a pac 14x14 a zapojeni dev importovano z PIC32MX470F512L-80I_PF.bxl ...._PT.bxl
IC6 = ArdDisp:MIC841: Comparator intREF 1,24V 1,5-5,5V 1,5uA hyst-set-by-Rdiv (2x comp+RS), speed 15us/100mV 80us/10mV, types: MIC841Lxx push-pull if HTH>ref then low, MIC841Hxx push-pull if HTH>ref then high, MIC841Nxx open drain if HTH>ref then high imp
IC7 IC11 = Microchip-AON:24*: Serial EEPROM I2C
IC8 = ACB:LT3971: LT3971 38V, 1.2A, 2MHz Step-Down Regulator with 2.8μA Quiescent Current 5,6$ ext P-ch curr lim const on time http://cds.linear.com/docs/en/datasheet/3971fd.pdf Hořa 7.6.2017
IC9 = Micron-U:M25P16: 16Mbit low voltage SPI Flash
IC10 = Touchstone-U:TSM9938: IC OPAMP CURRENT SENSE SOT23-5
IC12 = TexasInstruments-AON:SN65HVD3082E: RS-422/485 TRX 1RX 1TX
IC13 = ACB:REF3025: REF3025 2.5V 0,2% 42uA Hora
IC14 IC15 = Semtech-AOM:SR05: IC TVS ARRAY 2-LINE 5V SOT-143
IC16 = Microchip-AON:MCP6042: OAMP 14kHz LowPower 0,6uA G=1 stable OutCapLoad 70p/50k 10n/10k RailToRail VSS+0,4V VDD-0,5V
J3 J4 = ACB:RJ8-8
J12 = ACB:USB: USB connector Type A Copy from TTSKK and redesign. Hořa 10.6.2017
J17 = CON-pinHeader-AON:MA05-1
JP1 = SmdDisc:JP3CLOSE12
L7 L8 L10-L13 = DISCRETE:L-1206
L9 = Sumida-UT:NR6028: NR6028, NRS6028 6x6x2,5mm, NR6045, NRS6045 6x6x4,5mm
O1 O23 O31 O44 T5 T7 T15 T27 T32 T33 T36 = TESTPAD:PIC-OUT: Docasna soucastka na smerovani wire k procesoru bez pripojeni k procesoru
O5-O8 O12 O13 O15 O16 O29 O30 O41 O42 T3 T13 T14 T45 = TESTPAD:PIC-RPX: Docasna soucastka na smerovani wire k procesoru bez pripojeni k procesoru
PCB1 = ACB:PCB-ACB
Q1 Q2 = Toshiba-AON:SSM6P49: MOSFET P-CH DUAL 30V UDFN6, 4A, 20V
Q4 = Fairchild-AON:FDG6303N: Dual N-channel digital FET 25V/0.5A 0.45Ohm
Q5 = Fairchild-AON:FDC6506D: Dual P-Channel Logic Level PowerTrench MOSFET -1.8A, -30 V RDS(on) = 0.170 Ohm @ VGS = -10 V RDS(on) = 0.280 Ohm @ VGS = -4.5 V
R17-R34 R40-R49 R65 R71-R73 R75 R77 R82 R90-R103 R128-R130 R132 = DISCRETE:R-0603
R35-R39 R105 R106 = DISCRETE:R-0805
REF1 REF2 = technol:REF
T37-T39 = TESTPAD:PIN-AN: Docasna soucastka na smerovani wire k procesoru bez pripojeni k procesoru
TP1 TP2 TP4 = TESTPAD:ROUND_SMD: Generic round SMD testpad
X1 = TXC_Tech-U:XTAL

## Net classes
1 HV: clearance 0.3 mm to class 0

## Board
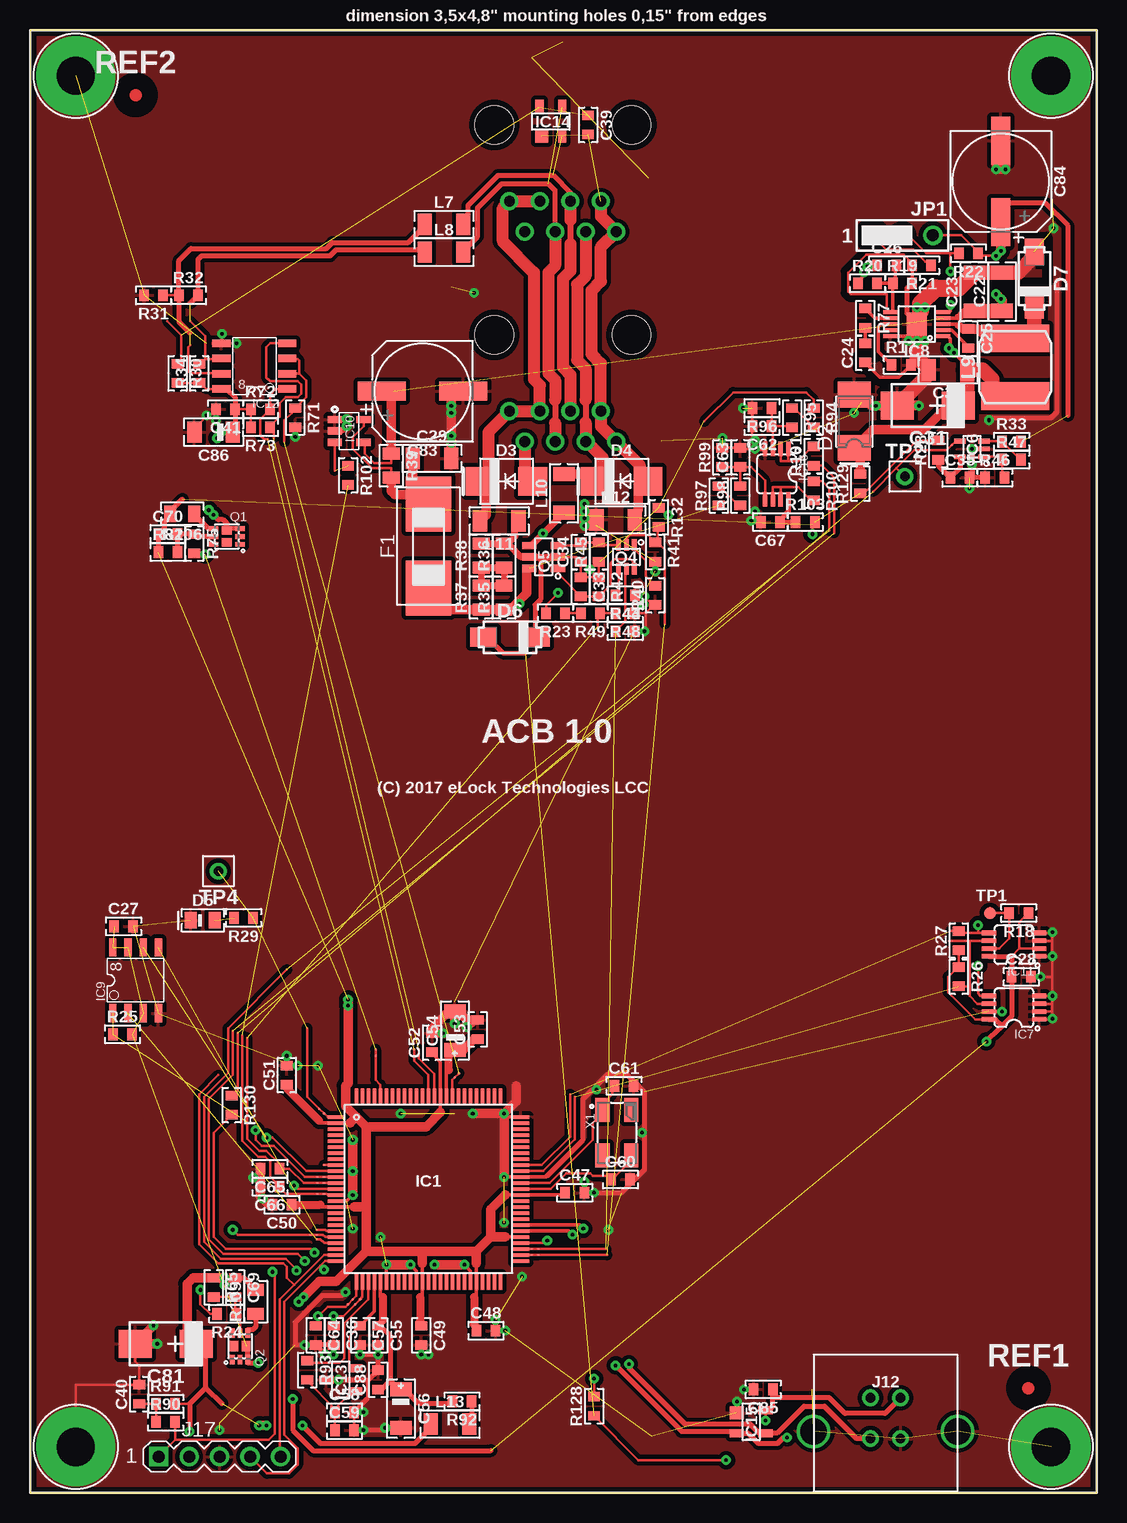
[diagram p3: board, top side]
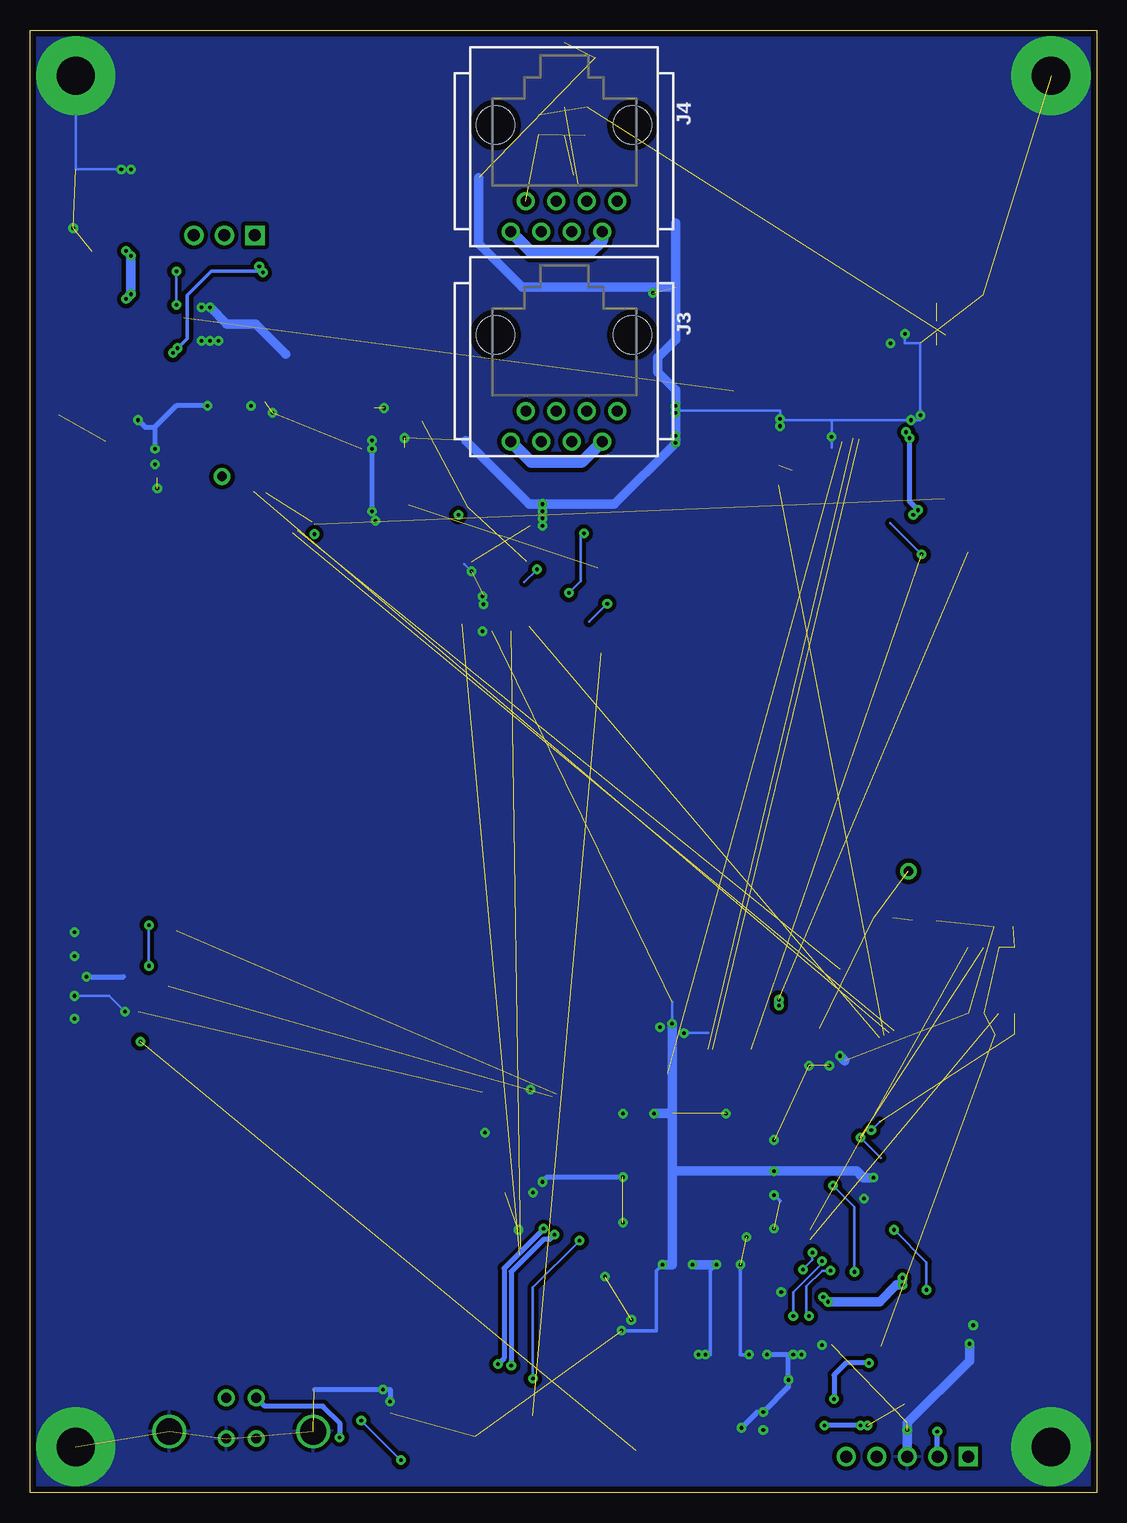
[diagram p4: board, bottom side, seen from below]

Size 88.9 x 121.92 mm. Coordinates in mm from the lower left corner, seen from the top.
Copper layers (1*16): Top 0.035mm / dielectric 1.5mm / Bottom 0.035mm
Design rules "default *": minimum track width 0.2mm, minimum drill 0.3mm, track to track 0.2mm, track to pad 0.2mm, pad to pad 0.2mm, via to via 0.2mm, smd to smd 0.001mm, copper to edge 0.5mm, drill to drill 0.2mm, minimum pad ring 0.3mm, minimum via ring 0.25mm, stop-mask expansion 0.1mm, vias tented up to drill 0.6mm, thermal gap 0.35mm
tRestrict: 34 lines

### Footprints (pad centres in the part's own frame; a part is rotated, then mirrored left to right if it is on the bottom)
1206 = smd 1.19 x 1.79: 1 -1.6,0; 2 1.6,0
0603 = smd 0.79 x 0.99: 1 -0.8,0; 2 0.8,0
CT-C = smd 2.743 x 2.311: + -2.54,0; - 2.54,0
1206-POL-C = smd 1.19 x 1.79: + -1.6,0; - 1.6,0
CAP_8MM_DIA_SMT = smd 1.59 x 3.99: 1 0,3.4; 2 0,-3.4
SMA = smd 2.159 x 2.743: + -2.311,0.003; - 2.108,-0.002
SMB = smd 2.4 x 2.4: A 2.2,0; C -2.2,0
0805-POL-D = smd 0.99 x 1.39: A 1,0; K -1,0
SMA' = smd 2.21 x 1.575: A -2.223,0; K 2.223,0
LITTLEFUSE0154 = smd 4.6 x 3.8: 1 3.5,0; 2 -3.5,0
TQFP100_14X14_0,5MM = smd 1.39 x 0.28: 1 -7.7,6; 2 -7.7,5.5; 3 -7.7,5; 4 -7.7,4.5; 5 -7.7,4; 6 -7.7,3.5; 7 -7.7,3; 8 -7.7,2.5; 9 -7.7,2; 10 -7.7,1.5; 11 -7.7,1; 12 -7.7,0.5; 13 -7.7,0; 14 -7.7,-0.5; 15 -7.7,-1; 16 -7.7,-1.5; 17 -7.7,-2; 18 -7.7,-2.5; 19 -7.7,-3; 20 -7.7,-3.5; 21 -7.7,-4; 22 -7.7,-4.5; 23 -7.7,-5; 24 -7.7,-5.5; 25 -7.7,-6; 51 7.7,-6; 52 7.7,-5.5; 53 7.7,-5; 54 7.7,-4.5; 55 7.7,-4; 56 7.7,-3.5; 57 7.7,-3; 58 7.7,-2.5; 59 7.7,-2; 60 7.7,-1.5; 61 7.7,-1; 62 7.7,-0.5; 63 7.7,0; 64 7.7,0.5; 65 7.7,1; 66 7.7,1.5; 67 7.7,2; 68 7.7,2.5; 69 7.7,3; 70 7.7,3.5; 71 7.7,4; 72 7.7,4.5; 73 7.7,5; 74 7.7,5.5; 75 7.7,6 | smd 0.28 x 1.39: 26 -6,-7.7; 27 -5.5,-7.7; 28 -5,-7.7; 29 -4.5,-7.7; 30 -4,-7.7; 31 -3.5,-7.7; 32 -3,-7.7; 33 -2.5,-7.7; 34 -2,-7.7; 35 -1.5,-7.7; 36 -1,-7.7; 37 -0.5,-7.7; 38 0,-7.7; 39 0.5,-7.7; 40 1,-7.7; 41 1.5,-7.7; 42 2,-7.7; 43 2.5,-7.7; 44 3,-7.7; 45 3.5,-7.7; 46 4,-7.7; 47 4.5,-7.7; 48 5,-7.7; 49 5.5,-7.7; 50 6,-7.7; 76 6,7.7; 77 5.5,7.7; 78 5,7.7; 79 4.5,7.7; 80 4,7.7; 81 3.5,7.7; 82 3,7.7; 83 2.5,7.7; 84 2,7.7; 85 1.5,7.7; 86 1,7.7; 87 0.5,7.7; 88 0,7.7; 89 -0.5,7.7; 90 -1,7.7; 91 -1.5,7.7; 92 -2,7.7; 93 -2.5,7.7; 94 -3,7.7; 95 -3.5,7.7; 96 -4,7.7; 97 -4.5,7.7; 98 -5,7.7; 99 -5.5,7.7; 100 -6,7.7
SC-70-5 = smd 0.39 x 0.99: 1 -0.65,-1; 2 0,-1; 3 0.65,-1; 4 0.65,1; 5 -0.65,1
MSOP-08 = smd 0.38 x 1.2: 1 -1,-2.1; 2 -0.35,-2.1; 3 0.3,-2.1; 4 0.95,-2.1; 5 0.95,2.1; 6 0.3,2.1; 7 -0.35,2.1; 8 -1,2.1
MSOP10EXP = smd 0.3 x 1.2: 1 -1,-2.2; 2 -0.5,-2.2; 3 0,-2.2; 4 0.5,-2.2; 5 1,-2.2; 6 1,2.2; 7 0.5,2.2; 8 0,2.2; 9 -0.5,2.2; 10 -1,2.2 | smd 1.88 x 1.68: EP 0,0
SO-08 = smd 0.61 x 1.524: 1 -1.905,-2.743; 2 -0.635,-2.743; 3 0.635,-2.743; 4 1.905,-2.743; 5 1.905,2.743; 6 0.635,2.743; 7 -0.635,2.743; 8 -1.905,2.743
SOT23-5 = smd 0.6 x 1.2: 1 -0.95,-1.206; 2 0,-1.206; 3 0.95,-1.206; 4 0.95,1.206; 5 -0.95,1.206
SO08 = smd 0.61 x 1.524: 1 -1.905,-2.743; 2 -0.635,-2.743; 3 0.635,-2.743; 4 1.905,-2.743; 5 1.905,2.743; 6 0.635,2.743; 7 -0.635,2.743; 8 -1.905,2.743
SOT23 = smd 0.69 x 1.19: 1 0.95,1.2; 2 -0.95,1.2; 3 0,-1.2
SOT-143 = smd 1.09 x 1.19: 1 -0.75,-1.2 | smd 0.69 x 1.19: 2 0.95,-1.2; 3 0.95,1.2; 4 -0.95,1.2
RJ8-8-180 = drill 0.9 pad 1.4: 1 -4.445,6.35; 2 -3.175,8.89; 3 -1.905,6.35; 4 -0.635,8.89; 5 0.635,6.35; 6 1.905,8.89; 7 3.175,6.35; 8 4.445,8.89 | hole 3.2: 5.715,0; -5.715,0
USB_B_180 = drill 0.8 pad 1.4: 1_+5V 1.25,2.8; 2_D- -1.25,2.8; 3_D+ -1.25,-0.6; 4_GND 1.25,-0.6 | drill 2.2 pad 2.8: SH1 -6,0; SH2 6,0
MA05-1 = drill 1 pad 1.6 square: 1 -5.08,0 | drill 1 pad 1.6: 2 -2.54,0; 3 0,0; 4 2.54,0; 5 5.08,0
JP3CLOSE12 = drill 1 pad 1.626 square: 1 -2.54,0 | drill 1 pad 1.626: 2 0,0; 3 2.54,0
NR6028 = smd 2.3 x 5.7: 1 2.4,0; 2 -2.4,0
TEMP-PAD = smd 0.2 x 0.2: P$1 0,0
PCB-ACB = drill 3.2 pad 6.6: PAD_GND_1 3.81,118.11; PAD_GND_2 85.09,118.11; PAD_GND_3 3.81,3.81; PAD_GND_4 85.09,3.81
MICRO_FET = smd 0.4 x 0.8: 1 -0.65,-1.1; 2 0,-1.1; 3 0.65,-1.1; 4 0.65,1.1; 5 0,1.1; 6 -0.65,1.1 | smd 0.7 x 0.86: P1 -0.5,0; P2 0.5,0
SC70-6 = smd 0.39 x 0.99: 1 -0.65,-1; 2 0,-1; 3 0.65,-1; 4 0.65,1; 5 0,1; 6 -0.65,1
SSOT-6 = smd 0.6 x 1.2: 1 -0.95,-1.2; 2 0,-1.2; 3 0.95,-1.206; 4 0.95,1.2; 5 0,1.2; 6 -0.95,1.2
0805 = smd 0.99 x 1.39: 1 -1,0; 2 1,0
SMD_ROUND_1MM = smd 1 x 1: P$1 0,0
TH_ROUND_14MM08MM = drill 0.8 pad 1.4: P$1 0,0
7B = smd 2 x 1.2: 1 -1.9,-1.2; 2 1.9,-1.2; 3 1.9,1.2; 4 -1.9,1.2

### Placement (x,y rotation side)
C22  81,100.1 90 top
C23  78.7,100.1 90 top
C24  69.6,95 90 top
C25  78.2,96.2 270 top
C26  71.4,102.3 0 top
C27  7.8,47.2 0 top
C28  82.6,43 0 top
C29  33.5,86.2 0 top
C30  76.5,93.6 180 top
C31  74.8,90.6 180 top
C33  45.9,75.5 270 top
C34  45.9,78.4 90 top
C35  77.5,84.6 0 top
C36  25.3,13.1 270 top
C39  46.5,114 270 top
C40  9.1,8.2 90 top
C41  16.3,90.3 180 top
C47  45.4,25 0 top
C48  38,13.5 0 top
C49  32.6,13.1 270 top
C50  21,24 180 top
C51  21.4,34.8 90 top
C52  33.5,37.5 90 top
C53  37.3,38.6 90 top
C54  35.4,38.5 90 top
C55  29,13.1 270 top
C56  30.9,7 270 top
C57  27.5,13.1 270 top
C58  26.2,6.7 0 top
C59  26.2,5.2 0 top
C60  49.2,26.1 0 top
C61  49.5,33.9 0 top
C62  61,88.9 180 top
C63  59.2,86.3 90 top
C64  23.8,13.1 270 top
C65  20,27 180 top
C66  20,25.5 180 top
C67  61.7,80.9 180 top
C69  17.1,17.1 270 top
C70  11.5,79.9 0 top
C81  11.3,12.4 180 top
C83  32.7,91.8 90 top
C84  80.9,109.3 180 top
C85  61.1,8.6 180 top
C86  15.3,88.4 180 top
C88  29,9.4 90 top
D2  68.7,89.4 90 top
D3  39.7,84.3 0 top
D4  49.3,84.3 0 top
D5  14.4,47.7 0 top
D6  SS14  [SMA']  40,71.3 0 top
D7  SS14  [SMA']  83.7,101.2 270 top
F1  33.2,78.9 90 top
IC1  33.2,25.3 0 top
IC6  78.5,87 90 top
IC7  82,40.45 90 top
IC8  73.9,97.4 90 top
IC9  8.8,42.7 0 top
IC10  26.6,88.5 270 top
IC11  82,45.7 90 top
IC12  18.7,93.9 90 top
IC13  25.9,9.4 270 top
IC14  43.4,114.3 0 top
IC15  60.1,5.9 270 top
IC16  62.2,84.9 180 top
J3  44.4,96.5 180 bottom
J4  44.4,114 180 bottom
J12  71.3,5.1 0 top
J17  15.8,3 0 top
JP1  72.7,104.8 0 top
L7  34.5,105.7 0 top
L8  34.5,103.4 0 top
L9  82.1,93.8 90 top
L10  44.5,83.3 90 top
L11  39.1,81 180 top
L12  48.8,81.1 0 top
L13  35,5.7 0 top
O1  24.5,31.6 0 top
O5  24.5,27.3 0 top
O6  24.5,26.3 0 top
O7  24.5,25.8 0 top
O8  24.5,24.9 0 top
O12  23.9,21.9 0 top
O13  23.9,21.1 0 top
O15  26.9,16.1 90 top
O16  27.5,16.1 0 top
O23  28.8,36.4 0 top
O29  32,36.4 0 top
O30  32.4,36.4 0 top
O31  35.4,34.6 0 top
O41  42.35,20.3 180 top
O42  41.8,19.8 180 top
O44  23.9,21.5 0 top
PCB1  0,0 0 top
Q1  16.4,79.7 90 top
Q2  17.5,12.2 0 top
Q4  49.7,78 180 top
Q5  42.8,78 90 top
R17  72.6,94 0 top
R18  82.4,48.3 180 top
R19  72.7,100.8 0 top
R20  69.8,100.8 0 top
R21  74.3,102.3 180 top
R22  78.2,103.3 180 top
R23  43.8,73.3 180 top
R24  16.4,14.9 180 top
R25  7.7,38.2 0 top
R26  77.4,43 270 top
R27  77.4,46 90 top
R28  75.7,86.9 90 top
R29  17.8,47.9 180 top
R30  12.3,93.3 270 top
R31  10.3,99.8 180 top
R32  13.2,99.8 0 top
R33  81.8,87.6 0 top
R34  14.1,93.3 90 top
R35  39.5,74.6 90 top
R36  39.5,78.1 90 top
R37  37.6,74.6 90 top
R38  37.6,78.1 90 top
R39  30.1,85.6 270 top
R40  52.1,74.8 90 top
R41  52.1,78.4 270 top
R42  47.4,75.5 270 top
R43  49.6,74.8 180 top
R44  49.6,71.8 0 top
R45  47.4,78.4 90 top
R46  80.4,84.6 0 top
R47  81.8,86.1 0 top
R48  49.6,73.3 180 top
R49  46.7,73.3 180 top
R65  15.3,17.1 270 top
R71  22.1,89.6 270 top
R72  19.2,90.3 0 top
R73  19.2,88.8 180 top
R75  13.7,79.1 270 top
R77  69.6,97.9 270 top
R82  11.5,78.4 0 top
R90  11.3,5.9 0 top
R91  11.3,7.4 0 top
R92  36,7.6 180 top
R93  23.1,10.2 270 top
R94  65.3,89.6 270 top
R95  63.5,89.6 270 top
R96  61,90.4 180 top
R97  57.4,83.1 90 top
R98  59.2,83.1 90 top
R99  57.7,86.3 90 top
R100  65.3,83.5 270 top
R101  65.3,86.4 90 top
R102  26.5,84.8 270 top
R103  64.6,80.9 0 top
R105  18.8,15.9 90 top
R106  12.7,81.6 180 top
R128  47,7.2 90 top
R129  69.2,84.1 90 top
R130  16.8,32.3 270 top
R132  52.4,81.3 270 top
REF1  83.2,8.7 0 top
REF2  8.8,116.5 0 top
T3  23.95,25.8 180 top
T5  42.35,19.8 180 top
T7  41.8,20.3 180 top
T13  32,36.95 0 top
T14  32.4,36.95 270 top
T15  35.75,34.95 270 top
T27  23.95,26.3 270 top
T32  23.35,21.5 270 top
T33  28.8,36.95 270 top
T36  24.1,32 0 top
T37  26.5,15.7 0 top
T38  27.1,15.7 270 top
T39  23.95,24.9 270 top
T45  76.8,87.3 180 top
TP1  80,48.3 0 top
TP2  72.9,84.7 0 top
TP4  15.7,51.8 180 top
X1  48.9,30 270 top

### Tracks (layer width: path | path; a pad name or v marks a point on that pad's centre or on a via)
+3,3V-FILT
  Top 0.4: R28.1 75.7,85.6 C35.1 77.5,85.4 IC6.5
+3.3V  (via drill 0.3 pad 0.7, 0.3 pad 0.8)  (4 unrouted)
  Top 0.2: R105.2 19,16.9 | 13.3,7.4 R91.2 | R129.1 69.3,83.4 69.6,83.4 73.9,87.7 R28.2 | R103.2 65.2,80.7 v65.2,79.9
  Top 0.28: C47.1 44.8,24.8 IC1.62 39.6,24.8 | 24.1,31 24.1,30.8 IC1.2 26.7,30.8 | 24.2,24 24.2,23.8 IC1.16 27,23.8 | 32.5,16.3 32.7,16.3 IC1.37 32.7,19.1 | 32.5,14.3 32.5,13.9 C49.1 | 37,16.3 37.2,16.3 IC1.46 37.2,19.1 | IC1.55 39.6,21.3 | C52.1 33.5,36.6 34.2,35.9 IC1.86 34.2,31.7
  Top 0.3: C69.1 17,17.9
  Top 0.4: R82.1 C70.1 11.2,80.4 11.2,80.9 11.7,81.4 R106.2 11.7,81.8 12.7,82.8 | v16.2,17.9 C69.1 17.8,17.9 R105.2 | 14.65,8.75 16,7.4 | v13.3,5.1 13.3,7.4 14.65,8.75 | 14.65,8.75 14.65,11.59 C81.+ | v22.7,5.6 24.2,4.1 32.1,4.1 33.4,5.4 L13.1
  Top 0.68: C51.1 21.4,33.7 24.1,31 | C50.1 24.2,24 | 32.5,16.3 32.5,14.3 | 37,16.3 37,14 37.2,13.8 C48.1
  Top 0.8: R28.2 75.6,87.7 | C81.+ 13.1,12.4 13.1,17.4 13.6,17.9 R65.1 v16.2,17.9 v16.2,17.3 | 27.2,31.3 26.3,32.2 26.3,33.9 26.5,34.1 v26.5,40.6 v26.5,41.1 | 26.7,30.8 27.2,31.3 | 27.2,31.3 28,30.5 | 28,30.5 28,23.8 | 28,23.8 28,20.1 | 28,20.1 25.5,17.6 24.1,17.6 v22.8,16.3 | 28,30.5 33,30.5 34.2,31.7 | 28,20.1 32.9,20.1 | 32.9,20.1 37.2,20.1 | 37.2,20.1 38.4,21.3 | 38.4,21.3 38.4,23.6 39.6,24.8 | 38.4,21.3 39.6,21.3 | 37.2,20.1 37.2,19.1 | 32.7,19.1 32.7,19.9 32.9,20.1 | 27,23.8 28,23.8 | 19.3,5.6 v19.1,5.6 v19.7,5.6
  Bottom 0.4: J17.2 13.3,3.04 v13.3,5.1 | v19.7,5.6 v22.7,5.6
  Bottom 0.8: v26.5,41.1 v26.5,40.6 | v22.8,16.3 v22.4,15.9 18.1,15.9 16.7,17.3 v16.2,17.3 v16.2,17.9
+3.3V/1  (via drill 0.3 pad 0.7, 0.3 pad 0.8)  (6 unrouted)
  Top 0.2: R26.1 77.4,43.9 | R27.1 77.4,43.9 | 77.4,43.9 76.5,43 76.5,41.7 78.75,39.45 IC7.8 | IC11.2 82.45,45.35 | 82.45,45.35 81.8,44.7 | R18.1 82.45,47.55 82.45,45.35 | 80.75,38.55 80.75,38.65
  Top 0.4: v21.9,7.8 21.9,5.2 23.6,3.5 38.4,3.5 | Q2.P2 18.15,12.2 Q2.3 18.15,10.8 v19,10.8 | IC11.8 81.8,44.7 C28.1 81.8,39.7 81,38.9 | 81,38.9 80.75,38.65 v79.7,37.6 | IC7.8 80.45,39.45 81,38.9
  Bottom 0.4: v19,10.8 20.9,10.8 21.9,9.8 v21.9,7.8
+3.3V/2  (via drill 0.3 pad 0.8)
  Top 0.2: C41.1 R72.1 R73.2 | R30.2 R34.1 14.2,92.5 14.71,92 IC12.8
  Top 0.3: 16.55,80.35 Q1.P2
  Top 0.4: Q1.3 16.55,80.35 | Q1.P2 16.4,80.8 16.1,81.1 15.7,81.1 v15.3,81.5 v14.9,81.9 | v15.6,87.9 15.6,88.1 v15.9,88.4 C86.+ 17.1,88.6 C41.1 17.1,91.3 16.41,92 IC12.8
  Bottom 0.4: v14.9,81.9 15.6,82.6 v15.6,87.9
/3.3V1PWRON  (via drill 0.3 pad 0.7)
  Top 0.2: v14.2,16.9 14.2,15.7 15,14.9 R24.2 | IC1.21 24.6,21.3 24.4,21.5 O44.P$1 T32.P$1 17.3,21.5 v16.9,21.9
  Bottom 0.2: v14.2,16.9 14.2,19.2 v16.9,21.9
/3.3V2PWRON  (via drill 0.3 pad 0.8)  (1 unrouted)
  Top 0.2: R75.2 13.8,78.2 v14.6,78.2 | IC1.96 29.2,34 28.8,34.4 O23.P$1 T33.P$1
  Bottom 0.2: v14.6,78.2 17.2,80.8
/FMEM1-CS  (via drill 0.3 pad 0.7)  (2 unrouted)
  Top 0.2: IC1.11 O6.P$1 T27.P$1 22.9,26.3 20.3,28.9 19.3,28.9 18.8,29.4 v18.8,30.2
  Bottom 0.2: 18.1,30.9 v18.8,30.2
/MCLR  (via drill 0.3 pad 0.7)
  Top 0.2: IC1.13 22.3,25.3 v22,25.6 | 12.12,4.4 19.9,4.4 20.4,4.9 20.4,18.2 v20.2,18.4 | 12.12,4.4 J17.1 | 12.12,4.4 12.12,5.88 R90.2
  Bottom 0.2: v20.2,18.4 20.2,23.8 v22,25.6
A+  (1 unrouted)
  Top 0.4: L8.2 36.1,103.5 37.3,104.7 37.3,107.1 39.3,109.1 43.2,109.1 43.77,108.53 J4.4
  Top 0.5: 43.77,91.1 43.77,89.17
  Top 1: J4.4 43.77,102.27 43.2,101.7 43.2,93.3 43.77,92.73 43.77,91.1 | 43.77,89.17 J3.4
A++  (1 unrouted)
  Top 0.2: R34.2 14.2,94.1 14.6,94.5 | 14.6,94.5 15.92,94.5 IC12.6 | 13.35,97.65 14.6,96.4 14.6,94.5
  Top 0.4: 13.35,99.15 R32.2 14,102.8 14.3,103.1 25,103.1 25.5,103.6 32.7,103.6 L8.1
AVDD
  Top 0.28: IC1.30 29.2,16.3 29.4,16.3
  Top 0.4: C55.1 29.2,13.9 30,13.1 30,9.3 | 30,9.3 30.7,8.6 C56.+ 31.2,8.6 32.4,7.4 35.2,7.4 R92.2 | C88.1 29.3,8.6 30,9.3
  Top 0.6: 29.4,14.4 29.4,14.3 C55.1
  Top 0.68: 29.4,16.3 29.4,14.4
B-  (1 unrouted)
  Top 0.4: J3.5 45,90.11 | L7.2 36.1,106.1 36.5,106.5 36.5,107.3 39,109.8 43.6,109.8 45.03,108.36 J4.5
  Top 0.5: 45.03,106.1 45.03,104.1
  Top 1: J4.5 45.03,106.1 | 45.03,104.1 45.03,101.83 44.4,101.2 44.4,93.8 45.03,93.17 J3.5
B--  (1 unrouted)
  Top 0.2: 13.35,95.65 13.2,95.5 13.2,93.5 13.4,93.3 15.92,93.3 IC12.7 | R31.1 R32.1
  Top 0.4: 13.35,96.65 12.4,97.6 R32.1 12.4,102.7 13.4,103.7 24.7,103.7 25.2,104.2 31.5,104.2 32.5,105.2 32.5,105.3 L7.1
CURR-SENSE  (1 unrouted)
  Top 0.2: IC1.14 24.8,24.8 24.7,24.9 O8.P$1 T39.P$1 21.3,24.9 20.8,25.4 C66.1 20,26.3 20,27.6 19.6,28 19,28 17.7,29.3 17.7,38.1
D+  (via drill 0.3 pad 0.7, 0.3 pad 0.8)
  Top 0.28: IC1.57 45.8,22.3 v46.1,22
  Top 0.4: v49.9,10.7 49.9,10.4 54.6,5.7 60,5.7 60.75,4.95 IC15.3 62.25,4.95 64.5,7.2 66.2,7.2 68.9,4.5 J12.3_D+
  Bottom 0.4: v46.1,22 49.4,18.7 49.4,11.2 v49.9,10.7
D-  (via drill 0.3 pad 0.7, 0.3 pad 0.8)
  Top 0.28: IC1.56 44.9,21.8 v45.2,21.5
  Top 0.4: v48.8,10.6 54.3,5.1 58.5,5.1 58.65,4.95 IC15.2 59.85,4.95 60.7,4.1 62.3,4.1 62.8,4.6 v63.1,4.6
  Bottom 0.4: v45.2,21.5 45.6,21.1 46.1,21.1 48.8,18.4 v48.8,10.6 | J12.2_D- 69.35,7.2 64.5,7.2 63.1,5.8 v63.1,4.6
DGND  (via drill 0.3 pad 0.7, 0.3 pad 0.8)  (39 unrouted)
  Top 0.2: R96.2 C62.2 60.2,87.9 v60.4,87.7 v60.4,87 59.3,87 C63.2 R99.2 | C58.2 C59.2 | C28.2 v84.2,43 85.2,43 | 51.3,73.3 52,74 R40.1 51.9,74 v51.2,74.7 51.1,74.8 R43.1 | R71.2 v22.1,88 | v52.1,76.8 R41.2 | v15.5,89.4 C41.2 | C86.- 13.7,88.7 14.7,89.7 v14.7,89.8 | v16,96.6 16,95.85 IC12.5 17.09,95.81 17.1,95.8 v17.2,95.8 | R48.1 51.3,73.3 | R21.2 73.5,102.5 72.8,103.2 69.7,103.2 68.2,101.7 68.2,100.1 68.4,99.9 71.4,99.9 71.4,98.9 | C51.2 v22.3,35.6 | R44.2 v51.2,71.8 51.3,71.9 51.3,73.3 | C81.- 8.76,10.94 9.1,10.6 C40.2 3.81,9 PCB1.PAD_GND_3 | 28.1,7.8 28.1,9.3 28.2,9.4 | IC11.4 85.2,46.65 v85.2,46.7 85.2,46 | IC7.7 v81,40.1 | IC11.3 85.2,46 | 85.2,46 v85.2,44.7 | IC7.1 85.2,39.45 v85.2,39.5 85.2,40.1 | IC7.2 85.2,40.1 | IC7.3 85.2,40.75 | 85.2,40.75 85.2,40.1 | IC7.4 v85.2,41.4 | v85.2,41.4 85.2,40.75 | IC11.1 v85.2,44.7 | v85.2,44.7 85.2,43 | 85.2,43 v85.2,41.4 | v22.9,12.3 C64.2 | v51,30 51.2,30
  Top 0.28: IC1.45 36.7,18.5 v36.2,19 | v31.7,19 32.2,18.5 IC1.36 | IC1.31 v29.7,19 | IC1.15 26.4,24.3 v26.9,24.8 | IC1.75 39.8,31.3 v39.5,31.6 | C51.2 v21.4,36.4 | 43.1,26.4 43,26.3 IC1.65 v39.5,26.3
  Top 0.3: IC8.10 73.9,96.4 | R19.2 R21.2 | C24.1 70.8,93 72.4,93 R17.2 73.95,94.55 | v39.6,13.5 C48.2 v38.8,14.4
  Top 0.4: IC8.EP 73.9,97.5 73.1,98.3 73.1,100.4 R19.2 | v74.6,98.8 74.2,98.8 v73.9,98.8 | IC6.2 v78.5,87 v78.5,85.7 78.5,84.8 C35.2 R46.1 | IC16.4 v60.4,87 | v60.1,81 60.2,80.9 C67.2 60.4,81.4 v60.4,81.8 | IC10.2 26,88.5 v26.4,88.9 v26.4,89.5 26.35,89.45 IC10.1 | IC13.3 v25.7,9.4 28.2,9.4 C88.2 v29,11.5 | C59.2 v27.8,5.2 29.2,5.2 29.4,5.4 v29.6,5.4 C56.- | 50.3,34.3 51.2,33.4 51.2,30 51.2,26.9 50.2,25.9 | 43.1,26.4 46.1,29.4 46.1,32.8 46.9,33.6 v47.2,33.6 47.2,33.9 48.2,34.9 49.7,34.9 50.3,34.3 | 50.3,34.3 C61.2 | 50.2,25.9 49.3,25 v47,25 C47.2 v46.2,25.9 | 50.2,25.9 C60.2 | v79.9,89.4 80.1,89.6 85.1,89.6 85.6,90.1 85.6,101.05 | C49.2 v32.6,11.5 v33.2,11.5 | C57.2 27.5,11.6 | 27.5,11.6 v27.5,11.5 | C55.2 v29,11.5 | v29,11.5 27.6,11.5 27.5,11.6 | 28.1,7.8 C58.2 v27.8,6.7 | C85.2 v59.5,8.6 | v58.9,7.6 IC15.1 | v26.3,16.7 26,16.4 24.3,16.4 22.1,14.2 22.1,12.3 v22.9,12.3 | C64.2 v24.6,11.5 v25.3,11.5 C36.2 C64.2
  Top 0.8: v39.5,31.6 v36.9,31.6 | v73.2,96 v73.9,96 v74.6,96 | L12.1 47.2,81.5 46.2,81.5 v46.2,81.8 | v46.2,81.8 v46.2,81.2 v46.2,80.6 47.2,80.6 | v46.2,81.8 v46.2,82.4 | C29.2 v35.1,87.5 v35.1,88.1 v35.1,90 v35.1,90.6 35.1,91.8 C83.2 | v35.4,39.1 C54.- | v36.4,38.8 37,39.4 C53.2 36.4,39.4 35.7,40.1 C54.- | v34.4,38.3 C52.2 33.5,38.7 34.9,40.1 C54.- | 40.5,33.9 40.5,32.6 v39.5,31.6 | C31.- v70.48,90.6 70.1,90.6 69.8,90.9 69.31,90.9 D2.- | v31.7,19 v29.7,19 | v36.2,19 v33.7,19 | v39.5,26.3 v39.5,31.6 | v26.9,24.8 v26.9,26.8 v26.9,29.4 | C50.2 19.9,24 v19.4,24.5 19.2,24.7 C66.2 19.2,26.3 | 19.2,26.3 C65.2 | v18.6,26.25 19.15,26.25 19.2,26.3 | v10.3,13.94 C81.- v10.6,12.4 | v80.5,110.3 80.5,112.7 C84.2 81.3,112.7 v81.3,110.3 v80.5,110.3
  Top 0.813: v74.1,90.6 C31.-
  Top 1.2: 73.9,96.4 IC8.EP 73.9,97.9 74,98 arc90 74.1,98.1 74.1,98.5 74.2,98.5 | v73.9,96 73.9,94.6 73.95,94.55 C30.2 74.9,93.24 C31.- | 78.6,101.6 C23.2 C22.2 82.35,101.7 83.7,103.05 D7.A
  Top 1.4: 78.6,101.6 77.4,100.4 75.5,100.4 74.2,99.1 74.2,98.8 74.2,98.5
  Top 1.6: 73.9,96.4 v73.9,96
  Bottom 0.2: 52.7,77.4 v52.1,76.8 | v51.2,74.7 51.2,74.15 v51.1,74.05 | 22.1,89.4 26.4,89.4 v26.4,88.9 | 22.1,89.4 v15.5,89.4 14.7,89.4 v14.7,89.8 14.7,95.8 16,95.8 v16,96.6 | 22.1,89.4 v22.1,88 22.1,87.1 | v26.4,89.5 26.4,90.2 34.9,90.2 v35.1,90 | PCB1.PAD_GND_2 85.09,110.3 v81.3,110.3 | 32.4,38.3 v34.4,38.3 | 35.4,40.9 v35.4,39.1 | PCB1.PAD_GND_4 | v81,40.1 82.3,41.4 v85.2,41.4
  Bottom 0.28: v26.9,24.8 26.4,24.3 | v39.6,13.5 36.7,13.5 36.7,18.5 v36.2,19 | v32.6,11.5 32.2,11.5 32.2,18.5 v31.7,19 | v29,11.5 29.7,11.5 v29.7,19
  Bottom 0.4: v60.4,81.8 v60.4,87 | v74.1,90.6 76.7,90.6 78.5,88.8 | v25.3,11.5 25.7,11.5 | 25.7,11.5 v27.5,11.5 | 25.7,11.5 v25.7,9.4 25.7,8.8 v27.8,6.7 28.3,6.7 v29.6,5.4 | v58.9,7.6 58.9,8.6 v59.5,8.6 65.2,8.6 | v84.2,43 81.1,43 | 78.5,88.8 v78.5,87 | v79.9,89.4 79.3,88.8 78.5,88.8 | 85.09,3.7 PCB1.PAD_GND_4 | v46.2,25.9 45.8,26.3 v39.5,26.3
  Bottom 0.8: J17.3 15.8,5.8 10.6,11 v10.6,12.4 | 35.1,105.8 35.1,100.5 | 35.1,100.5 35.1,96.1 36.6,94.6 36.6,93.4 35.1,91.9 v35.1,90.6 v35.1,90 v35.1,88.1 v35.1,87.5 40.2,82.4 v46.2,82.4 47.3,82.4 52.6,87.7 | 51.5,109.6 51.5,104.1 47.9,100.5 35.1,100.5 | 35.4,31.6 v36.9,31.6 | 67.6,94.9 70.1,97.4 72.5,97.4 v73.9,98.8 | 35.4,31.6 35.4,26.8 | 35.4,26.8 35.4,19 v36.2,19 | v33.7,19 v31.7,19 | v18.6,26.25 19.45,26.25 20,26.8 v26.9,26.8 35.4,26.8 | 21,36 v21.4,36.4 | 35.4,31.6 v35.4,39.1
  other vias: 24,35.6 48.2,21.9 41,18 26.9,22 39.5,22.5 30.9,31.6 37,100 15.8,5.2 29.2,21.3 85.3,105.4 78.3,83.7 57.7,87.9 59.4,90.4 68.68,90
  pour Top (isolate 0.35): 0.5,0.5 88.5,0.5 88.5,121.5 0.5,121.5
  pour Bottom (isolate 0.35): 0.5,0.5 88.5,0.5 88.5,121.5 0.5,121.5
DGND-F  (2 unrouted)
  Top 0.8: L12.2 50.6,81.3 50.6,81.8 50.7,81.9 50.7,83.7 51.4,84.4
  Top 1: J4.7 47.58,106.38 J4.8 47.58,103.84 47.58,100.97 46.8,100.2 46.8,94.9 47.58,94.12 J3.7 47.58,88.88 J3.8 50.8,85.66 50.8,84.4 51.4,84.4 D4.A | J3.2 41.23,84.97 D3.A
  Bottom 1: J4.2 41.23,104.38 42.2,103.4 47.13,103.4 J4.8 | J3.2 42.94,85.9 47.13,85.9 J3.8
GATE-Q12A
  Top 0.2: Q5.1 44,76.6 C33.2 R42.2 48.4,75.7 48.4,77.5 48.7,77.8 50,77.8 50.35,77.45 Q4.6
GATE-Q12B
  Top 0.2: Q5.3 45.65,78.95 C34.2 R45.2 47.6,79 Q4.3
LAN-CTL  (1 unrouted)
  Top 0.2: IC12.3 21.44,94.5 22.3,94.5 22.43,94.36 22.43,93.27 | IC1.84 35.2,34.4 O31.P$1 T15.P$1 | 21.2,87.6 21.2,89.4 21.8,90 21.8,90.4 R71.1 23,91.3 23,92.7 22.43,93.27 | 22.43,93.27 IC12.2
LAN-RX  (1 unrouted)
  Top 0.2: IC12.1 20.5,92 20,91.5 R72.2 19.2,89.5 19.2,88.1 19.5,87.8 19.8,87.8 | IC1.88 33.2,34.8 32,36 O29.P$1 T13.P$1
LAN-TX  (1 unrouted)
  Top 0.2: IC12.4 20,95.81 19.7,95.5 19.7,92.95 20,92.65 22.3,92.65 22.6,92.35 22.6,91.6 22.3,91.3 21.3,91.3 20.8,90.8 20.8,89.7 20,88.9 R73.1 20.3,88.5 20.3,87.9 | IC1.87 33.7,34.9 32.4,36.2 O30.P$1 T14.P$1
LED-PIC  (2 unrouted)
  Top 0.2: IC1.1 24.8,31.3 O1.P$1 T36.P$1 23.1,33 23.1,38.7
N$13
  Top 0.2: IC11.7 80.75,45.35 81.6,46.2 R18.2 TP1.P$1
N$14  (1 unrouted)
N$16
  Top 0.2: Q4.1 50.35,78.65 51.3,77.7 51.3,76.4 R40.2
N$17
  Top 0.2: R43.2 49.05,75.05 Q4.4
N$18  (2 unrouted)
  Top 0.2: 11.45,97.65 12.6,96.5 12.6,94.3 12.3,94.3 R30.1
N$20
  Top 0.6: R38.1 R37.2 R35.2 R36.1 R38.1
N$21
  Top 0.2: R39.2 30.1,85.4 28.5,85.4 26.9,87 26.9,88 27.81,88.91 IC10.5
  Top 0.8: C29.1 31.9,83.2 | 31.9,83.2 32.7,82.4 F1.1 | 31.9,83.2 30.4,83.2 30.1,83.5 R39.2
N$24
  Top 0.4: R92.1 36.8,5.9 L13.2
N$27
  Top 0.2: IC6.1 80.75,86.35 R47.1 81,84.8 R46.2
N$28
  Top 0.2: R47.2 82.5,86.1 R33.1 80.95,87.65 IC6.3
N$32
  Top 0.2: IC1.64 43.3,25.8 46.9,29.4 46.9,30.8 47.7,31.6 X1.1 48,32.2 48,32.7 48.5,33.2 48.5,33.7 C61.1
N$36
  Top 0.4: Q1.4 14.85,80.35 14.1,81.1 13.8,81.1 13.8,81.5 R106.1
N$38  (via drill 0.3 pad 0.7)  (1 unrouted)
  Top 0.2: 40.65,74.25 v40.8,74.1
  Top 0.6: Q5.6 41.45,77.05 41.4,77 41.4,76.9
  Top 0.8: 41.4,76.9 41.4,75 40.65,74.25 40,73.6 R35.1 R37.1 34.7,73.6 33.2,75.1 F1.2
  Bottom 0.2: v40.8,74.1 42.3,72.6
N$39
  Top 0.2: IC1.63 43.4,25.3 44.7,26.6 46.7,26.6 46.9,26.4 48.7,26.4 | X1.3 50.1,27.7 48.8,26.4 48.7,26.4 | 48.7,26.4 C60.1
N$44
  Top 0.2: C59.1 C58.1 25.4,7 | R93.2 23.1,9.3 25.4,7 | IC13.1 26.85,8.45 25.4,7
N$48
  Top 0.2: R95.1 63.7,90.4 R94.2
N$49
  Top 0.2: R95.2 63.5,88.9 C62.1 | C62.1 R96.1 | IC16.3 61.9,88.9 C62.1
N$50
  Top 0.3: R19.1 71.9,98.4 IC8.6 | R20.2 R19.1 | R19.1 72,100.8 72.1,100.9 72.1,102.2 C26.2
N$51
  Top 0.3: R77.2 C24.2
N$52
  Top 0.3: IC8.3 77.2,97.4 77.3,97.3
  Top 0.5: 77.8,97 77.5,97.3 77.3,97.3 77.7,96.9
  Top 0.8: 77.8,97 C25.1 79,97 79.8,96.2 L9.1
  Top 1.2: L9.1 83.2,96.2 83.7,96.7 D7.K
N$53
  Top 0.3: IC8.8 70.9,97.4 70.7,97.2 70.7,95.1 R17.1
N$54
  Top 0.3: IC8.7 70.4,97.9 R77.1
N$55  (via drill 0.3 pad 0.8)
  Top 0.2: R22.2 76.7,103.3 | 76.7,103.3 v76.7,101.8 | 76.7,103.3 74.7,103.3 73.2,104.8 JP1.2
  Top 0.3: IC8.5 76.6,98.4 76.7,98.5 v76.7,99
  Bottom 0.2: v76.7,99 v76.7,101.8
N$56
  Top 0.4: R105.1 18.8,13.8 18.6,13.6 18.15,13.6 Q2.4
N$57
  Top 0.3: IC8.2 76.8,96.9 78.1,95.6 78.2,95.5 C25.2
N$60
  Top 0.2: R98.1 59,82.3 R97.2
N$62
  Top 0.2: R49.2 R23.1
N$63
  Top 0.2: C63.1 R99.1 | C63.1 R98.2 | IC16.5 61.25,84.35 60.1,85.5 C63.1
N$64
  Top 0.2: IC16.7 62.55,83.8 | 62.55,83.8 61.9,83.8 IC16.6 | R100.2 65.1,82.7 64,83.8 62.55,83.8
N$65
  Top 0.4: IC16.8 63.2,81.8 62.6,81.2 62.6,81 C67.1 R103.1
N$66
  Top 0.2: IC16.1 63.2,86 | 63.2,86 62.55,86 IC16.2 | R101.2 65.2,87.2 64,86 63.2,86
N$67
  Top 0.2: R65.2 C69.2 17.1,15 R24.1 17.5,14.6 Q2.5
N$68  (1 unrouted)
  Top 0.2: IC10.3 25.39,85.21
N$70
  Top 0.2: R90.1 R91.1 C40.1
N$73
  Top 0.4: Q1.5 13.9,79.7 R75.1 C70.2 R82.2
N$85  (via drill 0.3 pad 0.8)  (1 unrouted)
  Top 0.2: IC15.4 v61.3,6 | v58,2.7 50.7,2.7 R128.1
  Top 0.4: D6.A 38.1,71.3 39.4,70 41.3,70 | IC15.4 61.35,6.9 61.6,6.9 61.9,7.2 61.9,7.9 | 61.9,7.9 C85.1 | J12.1_+5V 71.25,6.6 67.9,6.6 66.6,7.9 61.9,7.9
  Bottom 0.2: v61.3,6 v58,2.7
N$87
  Top 0.2: R21.1 74.8,102.6 74.6,102.6 73.6,103.6 71.36,103.6 JP1.1
OUT+3.3V  (via drill 0.3 pad 0.8)
  Top 0.3: 76,96.4 IC8.1 76.5,96.4 76.7,96.2 76.7,95.5 v76.6,95.4 v77,95 78.1,93.9 C30.1 | R20.1 69,101 69.5,101.5 v69.5,101.7 69.5,101.9 v69.8,102.2 69.9,102.3 C26.1
  Top 0.8: D2.+ 70.21,88.6 74.54,88.6 76.54,90.6 C31.+ | D2.+ 68.59,87.09 | R129.2 69.2,87.09 D2.+
  Top 1.2: C31.+ 78.1,91.36 C30.1 79.4,93.6 80.2,92.8 80.2,91.6 80.4,91.4 L9.2
  Bottom 0.3: v69.5,101.7 69.6,101.8 73.8,101.8 75.8,99.8 75.8,96.2 v77,95
PGC
  Top 0.2: IC1.24 24.5,19.8 22,17.3 | 22,17.3 20.8,16.1 20.8,3.08 J17.5 | 22,17.3 21.4,17.9 21.4,18.8 21.1,19.1 15.7,19.1 14.1,20.7 14.1,33.2 15.7,34.8
PGD  (via drill 0.3 pad 0.8)
  Top 0.2: IC1.25 24.6,19.3 24.2,18.9 | J17.4 19.74,1.6 21.6,1.6 22.3,2.3 22.3,3.7 21.2,4.8 21.2,15.9 24.2,18.9 | 24.2,18.9 v24.5,18.6 | v23.7,20 23.4,20.3 16.3,20.3 15.3,21.3 15.3,30 R130.2
  Bottom 0.2: v24.5,18.6 23.7,19.4 v23.7,20
POWER-GOOD  (1 unrouted)
  Top 0.2: R130.1 17.3,33.6 17.3,38.3 | IC6.4 77.5,87.6 77.1,87.6 76.85,87.35 T45.P$1 76.4,86.9 73.7,86.9 72.2,85.4 | 72.2,85.4 70.25,83.45 | TP2.P$1 72.2,85.4
REF2,5V
  Top 0.2: C57.1 26.6,13 26.6,10.5 26.75,10.35 IC13.2
  Top 0.28: IC1.29 28.7,15.1 C57.1
REF-EN
  Top 0.2: IC1.28 28.2,16.1 26.2,14.1 26.2,11.2 25.8,10.8 23.3,10.8 R93.1
SCL1-EEPROM  (1 unrouted)
  Top 0.2: 78.3,42.2 78.3,41.4 78.95,40.75 IC7.6 | 78.3,42.2 78.3,46 | R26.2 78.3,42.2 | IC1.66 42.75,26.8 45.4,29.45 45.4,33 | IC11.6 78.3,46 | 78.3,46 76.6,46
SCLK2-SPI  (via drill 0.3 pad 0.7)  (1 unrouted)
  Top 0.2: IC1.10 23,26.8 20.2,29.6 v19.7,29.6
  Bottom 0.2: 18,27.9 v19.7,29.6
SD-CS
  Top 0.2: IC1.9 O5.P$1
SDA1-EEPROM  (via drill 0.3 pad 0.7)  (1 unrouted)
  Top 0.2: v79,43.9 79,41.6 79.2,41.4 IC7.5 | 79.95,46.7 IC11.5 79,46.65 | IC1.67 42.65,27.3 45,29.65 45,33.2 | 76.7,46.8 R27.2 77.55,46.65 79,46.65 | v79,47.3 79,46.65
  Bottom 0.2: v79,43.9 v79,47.3
SDI2-MISO  (1 unrouted)
  Top 0.2: IC1.22 24.5,20.8 24.2,21.1 24,21.1 O13.P$1
SDO2-MOSI  (1 unrouted)
  Top 0.2: IC1.20 24.7,21.8 24.6,21.9 24.35,21.9 O12.P$1
VBAT  (via drill 0.3 pad 0.8)  (2 unrouted)
  Top 0.2: R39.1 30.1,85.8 28.7,85.8 27.9,86.6 27.9,87.3 28.15,87.55 IC10.4 | JP1.3 77.6,104.8 79,103.4 R22.1 79.2,103.1 v80.5,103.1
  Top 0.3: IC8.4 77.2,97.9 77.3,98
  Top 0.4: 86.5,89.8 86.5,105.6 84.6,107.5 80.9,107.5 80.9,107.2 80.75,107.05
  Top 0.5: 78.5,98.3 C23.1 | 77.8,98.3 77.5,98 77.3,98 77.7,98.4
  Top 0.8: 77.8,98.3 78,98.3 78.2,98.5 C23.1 | v80.5,99.9 v80.9,99.5 81,99.4 C22.1 | 30.3,91.8 C83.1 30.1,91.8 R39.1 | v80.5,103.1 v80.9,103.5 C84.1 80.9,106.9 80.75,107.05
  Top 1.21: C23.1 C22.1
  Bottom 0.8: v80.9,99.5 v80.5,99.9 v80.5,103.1 v80.9,103.5
VBAT-LAN
  Top 0.8: D3.C 38,84.3 38,81.5 L11.2
  Top 1: J4.3 J4.1 39.4,107.09 39.4,104.3 41.99,101.7 41.99,92.81 42.49,92.31 J3.3 J3.1 38.2,88.39 38.2,84.9 37.6,84.3 D3.C
VBAT-LAN-F  (via drill 0.3 pad 0.7)  (2 unrouted)
  Top 0.2: R94.1 65.3,91.1 64.7,91.7 58.6,91.7 56.2,89.3 | C34.1 45.5,78 Q5.2 | C33.1 C34.1 | C33.1 R42.1 R45.1 | R45.1 47.5,77.6 | 47.3,76.3 v46.65,76.95 | v46.65,76.95 46,76.3 C33.1 | v46.65,76.95 46,77.6 C34.1 | v46.65,76.95 47.3,77.6 R45.1 | R132.1 53,81.5 v53.2,81.5
  Top 0.4: 42.4,78 42.6,77.8 42.6,74.5 42.1,74 42.1,71.8 42.22,71.68 D6.K | R42.1 47.3,76.3
  Top 0.6: Q5.2 42.4,78 Q5.5 40.9,78 40,78.9 39.7,78.9 R36.2 | R38.2 R36.2 | R36.2 39.8,79.1 40.4,79.7 40.4,80.3 40.8,80.7 40.8,81.1 L11.1
  Bottom 0.2: v46.65,76.95 47.7,75.9
VBAT-ON  (1 unrouted)
  Top 0.2: 52.3,79.2 R41.1 51.5,79.8 50,79.8 49.7,79.5 Q4.2 | 52.3,79.2 52.9,78.6 52.9,72.4 | 48.1,19.8 T5.P$1 O42.P$1 IC1.52 | 52.3,79.2 52.3,80.4 R132.2
VBAT-SENSE  (via drill 0.3 pad 0.7)  (1 unrouted)
  Top 0.2: R100.1 66,84.3 66.6,83.7 66.6,80.2 | v22.2,18.5 22.2,18.6 21.3,19.5 15.9,19.5 14.5,20.9 14.5,33 16.5,35 16.5,38.7 21.4,43.6 | IC1.26 27.2,16.4 O15.P$1 T37.P$1 26.3,15.5 24.8,15.5 v24,14.7 24,14.1 C64.1
  Bottom 0.2: v22.2,18.5 22.9,18.5 24.2,17.2 24.2,14.9 v24,14.7
VBATLAN-SENSE  (via drill 0.3 pad 0.7)  (1 unrouted)
  Top 0.2: v22.9,19.3 22.3,19.9 16.1,19.9 14.9,21.1 14.9,32.8 16.9,34.8 16.9,38.5 | R101.1 66,85.6 67,84.6 67,80 | IC1.27 27.7,16.3 O16.P$1 T38.P$1 26.1,14.7 v25.3,14.7 C36.1
  Bottom 0.2: v22.9,19.3 22.9,19.1 25.3,16.7 v25.3,14.7
VBUS  (via drill 0.3 pad 0.7, 0.3 pad 0.8)
  Top 0.2: IC1.54 42.9,20.8 v43.1,21 | v47,9.5 R128.2
  Bottom 0.2: v43.1,21 47,17.1 v47,9.5
VCAP
  Top 0.28: IC1.85 34.7,35.2 34.9,35.2
  Top 0.68: 34.9,35.2 34.9,36.9
  Top 0.8: 34.9,36.9 C54.+ 36.1,36.9 37,37.8 C53.1
VPS-ON  (1 unrouted)
  Top 0.2: Q4.5 49.7,76.6 49.6,76.5 49.6,72.6 R44.1 | 48,20.3 O41.P$1 T7.P$1 IC1.53
VPS-PWR
  Top 0.5: 46.3,91.1 46.3,89.2
  Top 0.6: 46.5,84.9 D4.C
  Top 0.8: L10.2 46.5,84.9
  Top 1: J4.6 46.3,101.41 45.6,100.7 45.6,94.4 46.3,93.69 46.3,91.1 | 46.3,89.2 J3.6 46.39,87.61 47.7,86.3 47.7,84.9 D4.C
VPS-PWR-F  (via drill 0.3 pad 0.7, 0.3 pad 0.8)
  Top 0.2: R23.2 43,74 v44,75
  Top 0.6: Q5.4 41.75,78.95 v42.75,79.95 L10.1
  Bottom 0.2: v44,75 43,76 43,79.7 v42.75,79.95
VPS-SENSE  (1 unrouted)
  Top 0.2: 18.1,37.9 18.1,29.5 19.1,28.5 19.7,28.5 20.8,27.4 C65.1 21.6,27 22.8,25.8 T3.P$1 O7.P$1 IC1.12 | R48.2 R49.1 47.3,73.1 47.3,72.2

### Text on the board
tPlace: ACB 1.0 | (C) 2017 eLock Technologies LCC